# Altium project DB46.PRJPCB
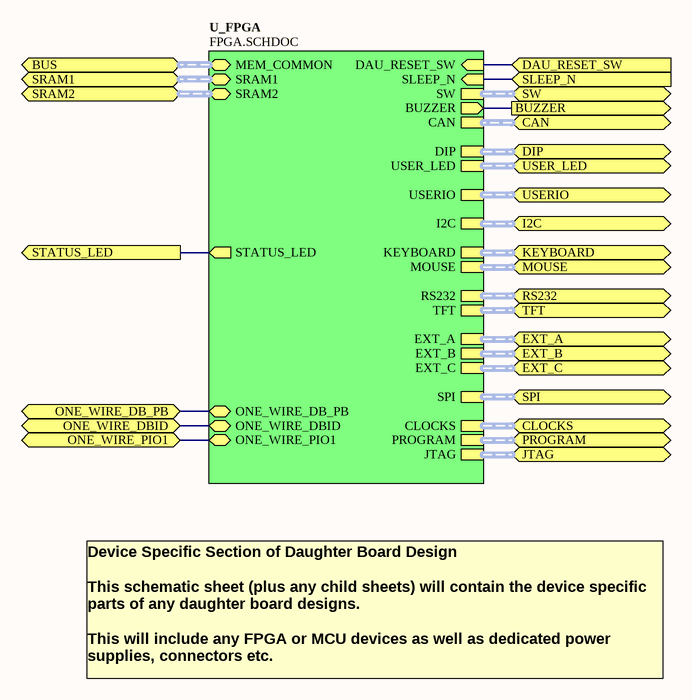
[diagram p0: DEVICES.SchDoc]
ProjectAddress1: L3, 12A Rodborough Road; ProjectAddress2: Frenchs Forest; ProjectAddress3: NSW 2086; ProjectAddress4: Australia; ProjectAssyNum: D-820-0031; ProjectOrganization: Altium Limited; ProjectRevision: 02; ProjectTitle: DB46 - Virtex4 SX35; ProjectTotalSheets: 23
9 sheets, 100 parts. Net scope: hierarchical (ports join the sheet entries above them; power ports are global).
Board files: DB46.PcbDoc, DB46_Panel.PcbDoc
Sheets:
  DEVICES.SchDoc
    U_FPGA = FPGA.SCHDOC
      U_FPGA_Power = FPGA_NonIO.SchDoc
      U_Bypass_3V3 = Bypass_FPGA_3V3.SchDoc
      U_Bypass_2V5 = Bypass_FPGA_2V5.SCHDOC
      U_Bypass_1V2 = Bypass_FPGA_1V2.SCHDOC
  DB46_Top.SchDoc
    U_PSU = PSU.SCHDOC
    U_DB46_Hardware_Kit = DB46_Hardware_Kit.SchDoc

## Sheet DEVICES.SchDoc: FPGA, LEDs and SRAM Memory
size A4; Organization: Altium Limited.; Address1: Level 3, 12a Rodborough Rd; Address2: Frenchs Forest 2086; Address3: NSW; Address4: AUSTRALIA; DocumentNumber: 2; SheetNumber: 3; SheetTotal: 23

### Sub-sheets
U_FPGA = FPGA.SCHDOC: SRAM1 (harness SRAM-256Kx16), SRAM2 (harness SRAM-256Kx16), MEM_COMMON (harness HOSTMEMORY), DAU_RESET_SW (in), BUZZER (out), ONE_WIRE_DBID (bidir), ONE_WIRE_DB_PB (bidir), ONE_WIRE_PIO1 (bidir), JTAG (harness HardSoft_JTAG), SW (harness SW5), DIP (harness SW8), USERIO (harness IO36), EXT_A (harness PBIO), EXT_B (harness PBIO), EXT_C (harness PBIO), USER_LED (harness LED8), SPI (harness DAU_SPI), I2C (harness I2C), CAN (harness CAN_INT), RS232 (harness RS232_INT), KEYBOARD (harness PS2), MOUSE (harness PS2), TFT (harness DAU_TFT), PROGRAM (harness DAU_CTRL), CLOCKS (harness DAU_CLK), STATUS_LED (out), SLEEP_N (in)

### Ports
BUS (harness HOSTMEMORY), BUZZER (out), CAN, CLOCKS, DAU_RESET_SW (in), DIP, EXT_A, EXT_B, EXT_C, I2C, JTAG, KEYBOARD, MOUSE, ONE_WIRE_DB_PB (bidir), ONE_WIRE_DBID (bidir), ONE_WIRE_PIO1 (bidir), PROGRAM, RS232, SLEEP_N (in), SPI, SRAM1, SRAM2 (harness SRAM-256Kx16), STATUS_LED (out), SW, TFT, USER_LED, USERIO

### Nets
BUZZER: port BUZZER, sheet U_FPGA/BUZZER
DAU_RESET_SW: port DAU_RESET_SW, sheet U_FPGA/DAU_RESET_SW
ONE_WIRE_DB_PB: port ONE_WIRE_DB_PB, sheet U_FPGA/ONE_WIRE_DB_PB
ONE_WIRE_DBID: port ONE_WIRE_DBID, sheet U_FPGA/ONE_WIRE_DBID
ONE_WIRE_PIO1: port ONE_WIRE_PIO1, sheet U_FPGA/ONE_WIRE_PIO1
SLEEP_N: port SLEEP_N, sheet U_FPGA/SLEEP_N
STATUS_LED: port STATUS_LED, sheet U_FPGA/STATUS_LED

### Buses and harness runs
harness port BUS = sheet U_FPGA/MEM_COMMON
harness port CAN = sheet U_FPGA/CAN
harness port CLOCKS = sheet U_FPGA/CLOCKS
harness port DIP = sheet U_FPGA/DIP
harness port EXT_A = sheet U_FPGA/EXT_A
harness port EXT_B = sheet U_FPGA/EXT_B
harness port EXT_C = sheet U_FPGA/EXT_C
harness port I2C = sheet U_FPGA/I2C
harness port JTAG = sheet U_FPGA/JTAG
harness port KEYBOARD = sheet U_FPGA/KEYBOARD
harness port MOUSE = sheet U_FPGA/MOUSE
harness port PROGRAM = sheet U_FPGA/PROGRAM
harness port RS232 = sheet U_FPGA/RS232
harness port SPI = sheet U_FPGA/SPI
harness port SRAM1 = sheet U_FPGA/SRAM1
harness port SRAM2 = sheet U_FPGA/SRAM2
harness port SW = sheet U_FPGA/SW
harness port TFT = sheet U_FPGA/TFT
harness port USER_LED = sheet U_FPGA/USER_LED
harness port USERIO = sheet U_FPGA/USERIO

### Notes on the sheet
- Device Specific Section of Daughter Board Design
  This schematic sheet (plus any child sheets) will contain the device specific parts of any daughter board designs.
  This will include any FPGA or MCU devices as well as dedicated power supplies, connectors etc.
- Sheet Title
- Project Title
- Size:
- Date:
- A4
- Assy:
- Time:
- Revision:
- Sheet
- of
- File:

## Sheet FPGA.SCHDOC: FPGA Connections
size A2; Organization: Altium Limited.; Address1: Level 3, 12a Rodborough Rd; Address2: Frenchs Forest 2086; Address3: NSW; Address4: AUSTRALIA; DocumentNumber: 3; SheetNumber: 4; SheetTotal: 23; PageSetup: Record=PageOptions|CenterHorizontal=True|CenterVertical=True|PrintScale=0.71|XCorrection=1.00|YCorrection=1.00|PrintKind=0|BorderSize=5000000|LeftOffset=0|BottomOffset=0|Orientation=2|PaperLength=4199|PaperWidth=2969|Scale=100|PaperSource=7|PrintQuality=600|MediaType=1|DitherType=10|PaperKind=A3 (297 x 420 mm)|PrintScaleMode=1
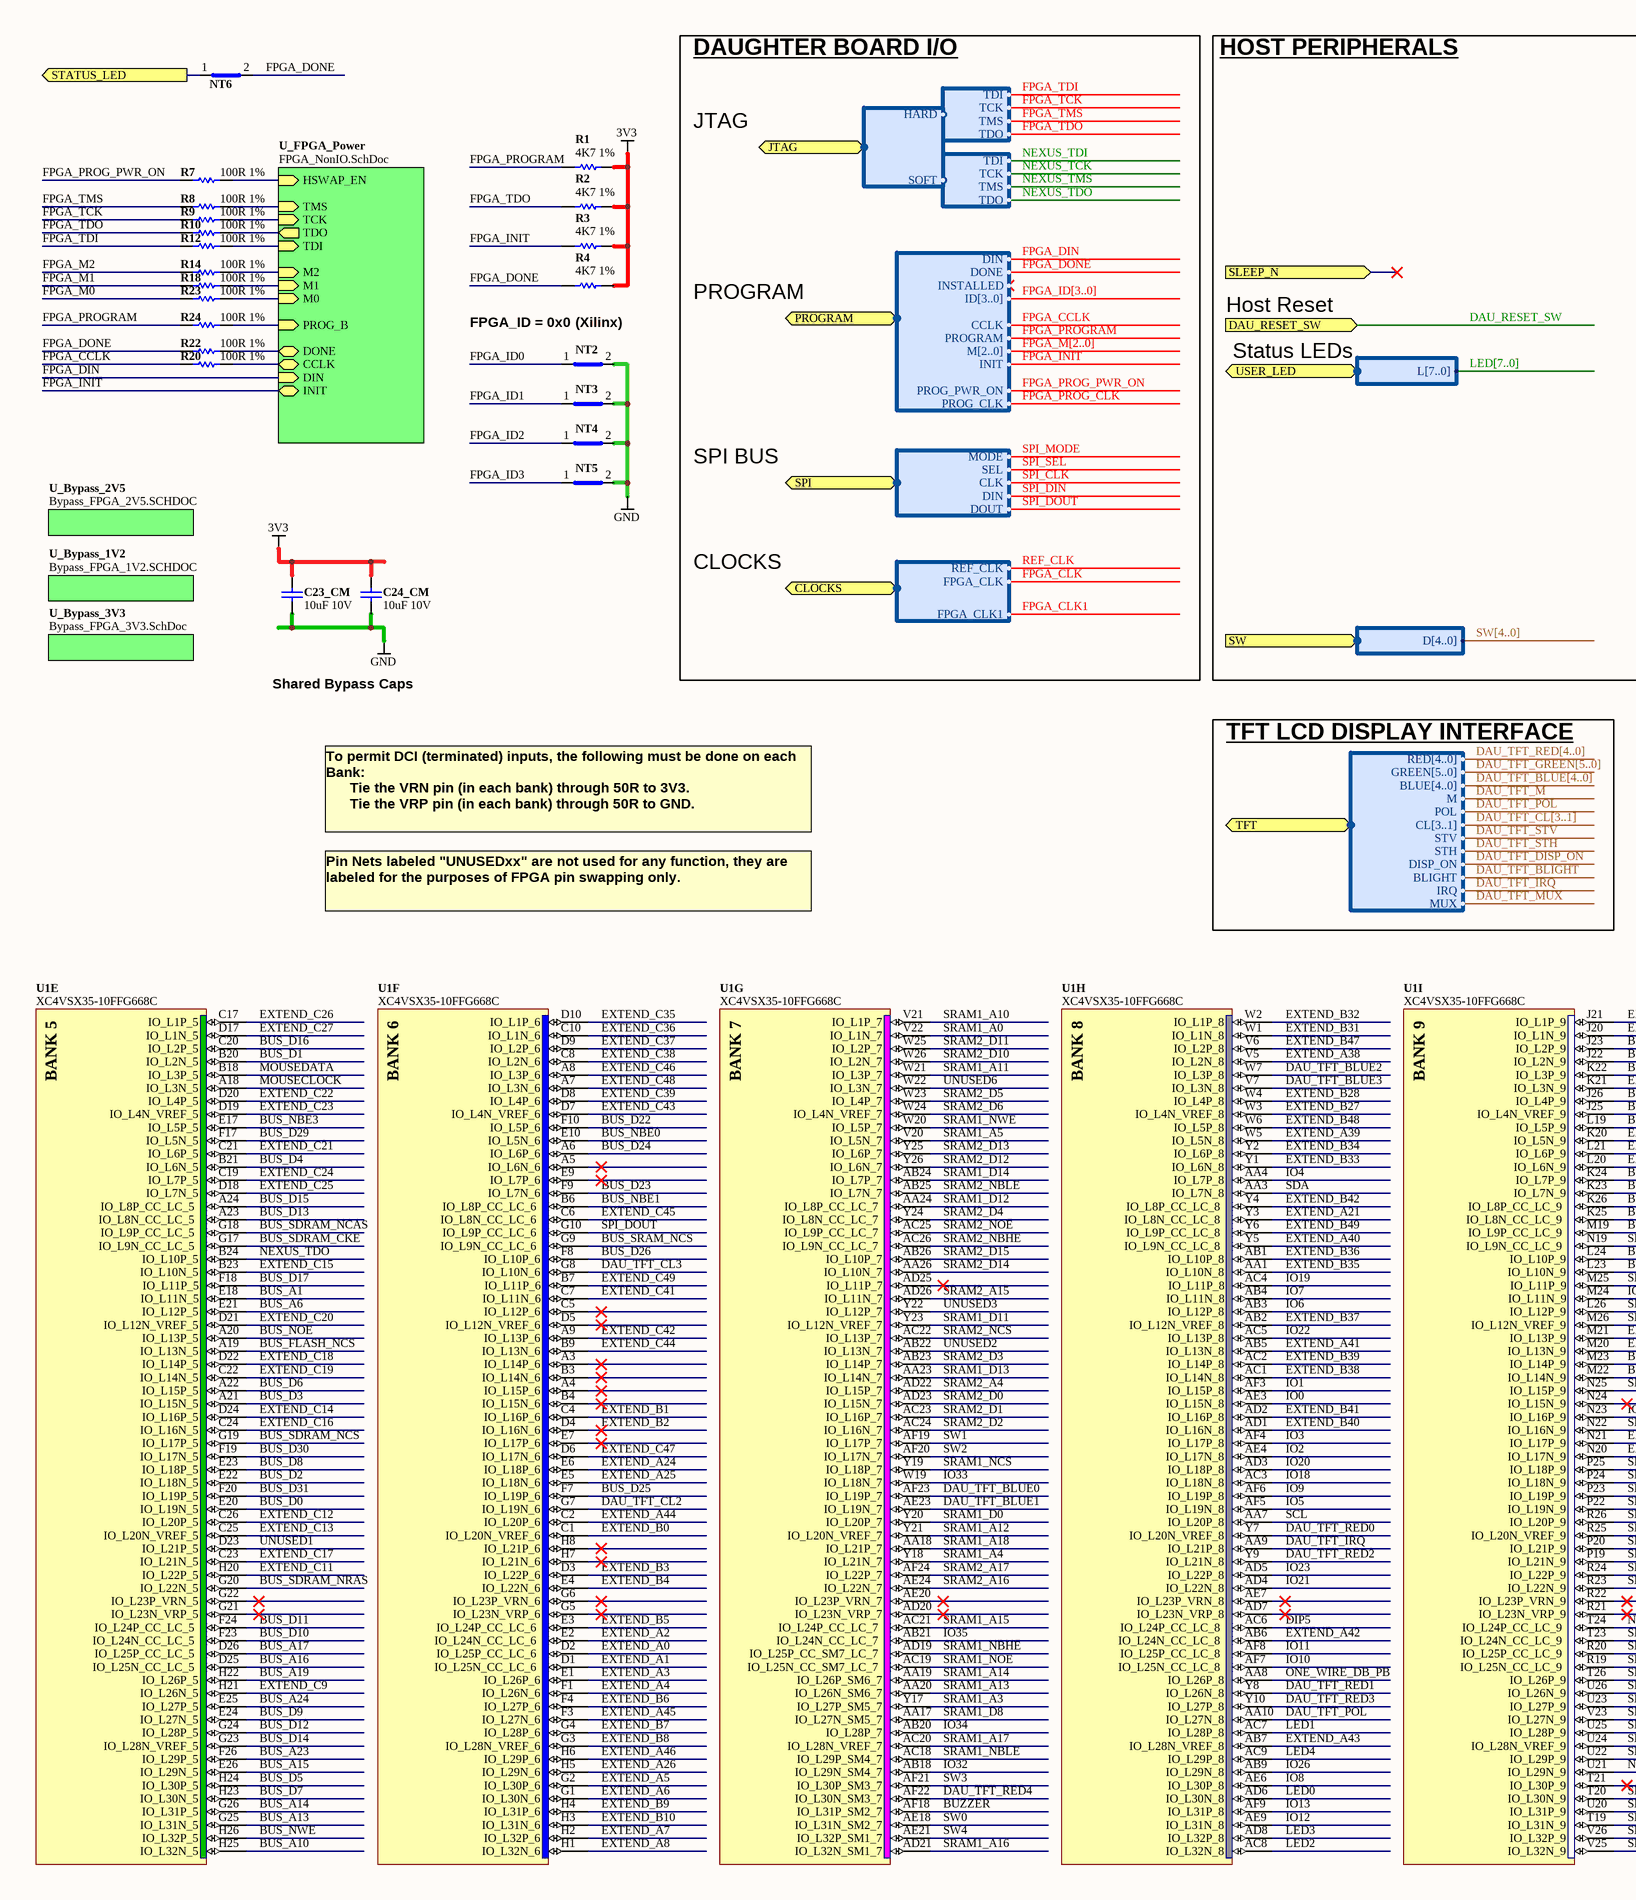
[diagram p1: FPGA.SCHDOC, left]
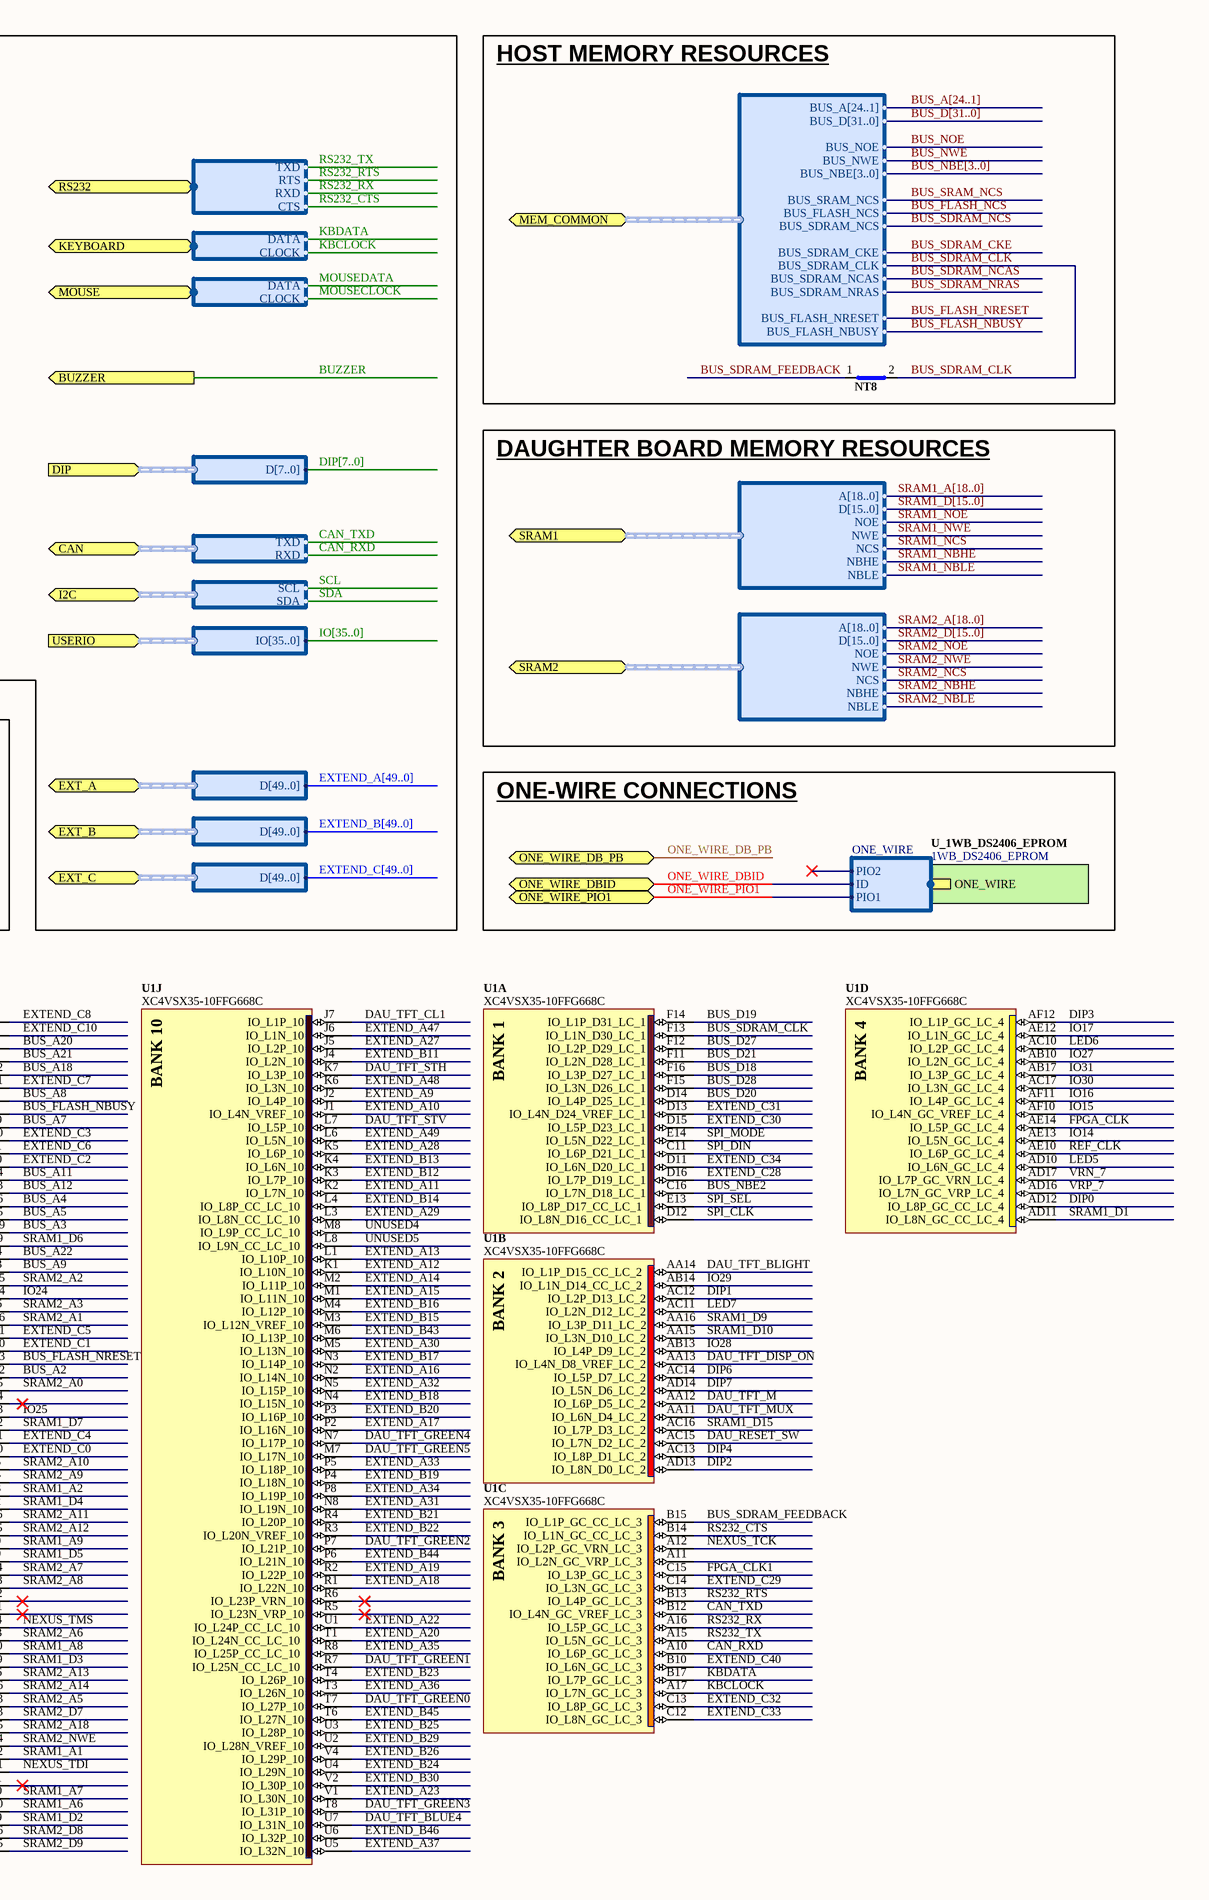
[diagram p2: FPGA.SCHDOC, right]

### Parts
C23_CM  10uF 10V  [CAPC2012-STAR]
C24_CM  10uF 10V  [CAPC2012-STAR]
NT2  Net Tie SMT2  [NETTIE-SMT2-8X8]  (value not drawn)  (net tie, no BOM)
NT3  Net Tie SMT2  [NETTIE-SMT2-8X8]  (value not drawn)  (net tie, no BOM)
NT4  Net Tie SMT2  [NETTIE-SMT2-8X8]  (value not drawn)  (net tie, no BOM)
NT5  Net Tie SMT2  [NETTIE-SMT2-8X8]  (value not drawn)  (net tie, no BOM)
NT6  Net Tie SMT2  [NETTIE-SMT2-8X8]  (value not drawn)  (net tie, no BOM)
NT8  Net Tie SMT2  [NETTIE-SMT2-8X8]  (value not drawn)  (net tie, no BOM)
R1  4K7 1%  [RESC1005-STAR]
R2  4K7 1%  [RESC1005-STAR]
R3  4K7 1%  [RESC1005-STAR]
R4  4K7 1%  [RESC1005-STAR]
R7  100R 1%  [RESC1005-STAR]
R8  100R 1%  [RESC1005-STAR]
R9  100R 1%  [RESC1005-STAR]
R10  100R 1%  [RESC1005-STAR]
R12  100R 1%  [RESC1005-STAR]
R14  100R 1%  [RESC1005-STAR]
R18  100R 1%  [RESC1005-STAR]
R20  100R 1%  [RESC1005-STAR]
R22  100R 1%  [RESC1005-STAR]
R23  100R 1%  [RESC1005-STAR]
R24  100R 1%  [RESC1005-STAR]
U1  XC4VSX35-10FFG668C  [XC4VLX25-10FF668C]  (parts A,B,C,D,E,F,G,H,I,J of 14)

### Blocks framed on the sheet
HOST MEMORY RESOURCES: NT8

### Sub-sheets
U_1WB_DS2406_EPROM = 1WB_DS2406_EPROM (file not in this document): ONE_WIRE (harness ONE_WIRE)
U_Bypass_1V2 = Bypass_FPGA_1V2.SCHDOC: no entries
U_Bypass_2V5 = Bypass_FPGA_2V5.SCHDOC: no entries
U_Bypass_3V3 = Bypass_FPGA_3V3.SchDoc: no entries
U_FPGA_Power = FPGA_NonIO.SchDoc: TMS (in), DONE (bidir), M1 (in), CCLK (bidir), M0 (in), M2 (in), TCK (in), HSWAP_EN (in), TDI (in), PROG_B (in), TDO (out), DIN (in), INIT (bidir)

### Ports
BUZZER (out), CAN (harness CAN_INT), CLOCKS (harness DAU_CLK), DAU_RESET_SW (in), DIP (harness SW8), EXT_A (harness PBIO), EXT_B (harness PBIO), EXT_C (harness PBIO), I2C (harness I2C), JTAG (harness HARDSOFT_JTAG), KEYBOARD (harness PS2), MEM_COMMON (harness HOSTMEMORY), MOUSE (harness PS2), ONE_WIRE_DB_PB (bidir), ONE_WIRE_DBID (bidir), ONE_WIRE_PIO1 (bidir), PROGRAM (harness DAU_CTRL), RS232 (harness RS232_INT), SLEEP_N (in), SPI (harness DAU_SPI), SRAM1 (harness SRAM-256Kx16), SRAM2 (harness SRAM-256Kx16), STATUS_LED (out), SW (harness SW5), TFT (harness DAU_TFT), USER_LED (harness LED8), USERIO (harness IO36)

### Harnesses
ONE_WIRE: ID, PIO1, PIO2
SRAM-256Kx16: A[18..0], D[15..0], NCS, NWE, NOE, NBHE, NBLE
HOSTMEMORY: BUS_A[24..1], BUS_D[31..0], BUS_NOE, BUS_NWE, BUS_NBE[3..0], BUS_SRAM_NCS, BUS_FLASH_NCS, BUS_SDRAM_NCS, BUS_SDRAM_CKE, BUS_SDRAM_CLK, BUS_SDRAM_NCAS, BUS_SDRAM_NRAS, BUS_FLASH_NRESET, BUS_FLASH_NBUSY
DAU_CLK: REF_CLK, FPGA_CLK, FPGA_CLK1
DAU_SPI: MODE, SEL, CLK, DIN, DOUT
DAU_CTRL: DIN, DONE, INSTALLED, ID[3..0], CCLK, PROGRAM, M[2..0], INIT, PROG_PWR_ON, PROG_CLK
JTAG: TMS, TDO, TDI, TCK
HARDSOFT_JTAG: HARD, SOFT
LED8: L[7..0]
SW5: D[4..0]
DAU_TFT: RED[4..0], GREEN[5..0], BLUE[4..0], M, POL, CL[3..1], STV, STH, DISP_ON, BLIGHT, IRQ, MUX
PS2: DATA, CLOCK
RS232_INT: RXD, TXD, RTS, CTS
IO36: IO[35..0]
SW8: D[7..0]
CAN_INT: TXD, RXD
I2C: SCL, SDA
PBIO: D[49..0]

### Nets
3V3: C23_CM.1 C24_CM.1 R1.2 R2.2 R3.2 R4.2
GND: C23_CM.2 C24_CM.2 NT2.2(Net2) NT3.2(Net2) NT4.2(Net2) NT5.2(Net2)
BUS_A1: U1.E18(IO_L11N_5)
BUS_A2: U1.M22(IO_L14N_9)
BUS_A3: U1.M19(IO_L9P_CC_LC_9)
BUS_A4: U1.K26(IO_L8P_CC_LC_9)
BUS_A5: U1.K25(IO_L8N_CC_LC_9)
BUS_A6: U1.E21(IO_L12P_5)
BUS_A7: U1.L19(IO_L5P_9)
BUS_A8: U1.J26(IO_L4P_9)
BUS_A9: U1.L23(IO_L10N_9)
BUS_A10: U1.H25(IO_L32N_5)
BUS_A11: U1.K24(IO_L7P_9)
BUS_A12: U1.K23(IO_L7N_9)
BUS_A13: U1.G25(IO_L31N_5)
BUS_A14: U1.G26(IO_L31P_5)
BUS_A15: U1.E26(IO_L29N_5)
BUS_A16: U1.D25(IO_L25N_CC_LC_5)
BUS_A17: U1.D26(IO_L25P_CC_LC_5)
BUS_A18: U1.K22(IO_L3P_9)
BUS_A19: U1.H22(IO_L26P_5)
BUS_A20: U1.J23(IO_L2P_9)
BUS_A21: U1.J22(IO_L2N_9)
BUS_A22: U1.L24(IO_L10P_9)
BUS_A23: U1.F26(IO_L29P_5)
BUS_A24: U1.E25(IO_L27P_5)
BUS_D0: U1.E20(IO_L19N_5)
BUS_D1: U1.B20(IO_L2N_5)
BUS_D2: U1.E22(IO_L18N_5)
BUS_D3: U1.A21(IO_L15N_5)
BUS_D4: U1.B21(IO_L6N_5)
BUS_D5: U1.H24(IO_L30P_5)
BUS_D6: U1.A22(IO_L15P_5)
BUS_D7: U1.H23(IO_L30N_5)
BUS_D8: U1.E23(IO_L18P_5)
BUS_D9: U1.E24(IO_L27N_5)
BUS_D10: U1.F23(IO_L24N_CC_LC_5)
BUS_D11: U1.F24(IO_L24P_CC_LC_5)
BUS_D12: U1.G24(IO_L28P_5)
BUS_D13: U1.A23(IO_L8N_CC_LC_5)
BUS_D14: U1.G23(IO_L28N_VREF_5)
BUS_D15: U1.A24(IO_L8P_CC_LC_5)
BUS_D16: U1.C20(IO_L2P_5)
BUS_D17: U1.F18(IO_L11P_5)
BUS_D18: U1.F16(IO_L3P_D27_LC_1)
BUS_D19: U1.F14(IO_L1P_D31_LC_1)
BUS_D20: U1.D14(IO_L4P_D25_LC_1)
BUS_D21: U1.F11(IO_L2N_D28_LC_1)
BUS_D22: U1.F10(IO_L5P_6)
BUS_D23: U1.F9(IO_L7N_6)
BUS_D24: U1.A6(IO_L6P_6)
BUS_D25: U1.F7(IO_L19P_6)
BUS_D26: U1.F8(IO_L10P_6)
BUS_D27: U1.F12(IO_L2P_D29_LC_1)
BUS_D28: U1.F15(IO_L3N_D26_LC_1)
BUS_D29: U1.F17(IO_L5N_5)
BUS_D30: U1.F19(IO_L17N_5)
BUS_D31: U1.F20(IO_L19P_5)
BUS_FLASH_NBUSY: U1.J25(IO_L4N_VREF_9) ; port MEM_COMMON.BUS_FLASH_NBUSY
BUS_FLASH_NCS: U1.A19(IO_L13N_5) ; port MEM_COMMON.BUS_FLASH_NCS
BUS_FLASH_NRESET: U1.M23(IO_L14P_9) ; port MEM_COMMON.BUS_FLASH_NRESET
BUS_NBE0: U1.E10(IO_L5N_6)
BUS_NBE1: U1.B6(IO_L8P_CC_LC_6)
BUS_NBE2: U1.C16(IO_L7N_D18_LC_1)
BUS_NBE3: U1.E17(IO_L5P_5)
BUS_NOE: U1.A20(IO_L13P_5) ; port MEM_COMMON.BUS_NOE
BUS_NWE: U1.H26(IO_L32P_5) ; port MEM_COMMON.BUS_NWE
BUS_SDRAM_CKE: U1.G17(IO_L9N_CC_LC_5) ; port MEM_COMMON.BUS_SDRAM_CKE
BUS_SDRAM_CLK: NT8.2(Net2) U1.F13(IO_L1N_D30_LC_1) ; port MEM_COMMON.BUS_SDRAM_CLK
BUS_SDRAM_FEEDBACK: NT8.1(Net1) U1.B15(IO_L1P_GC_CC_LC_3)
BUS_SDRAM_NCAS: U1.G18(IO_L9P_CC_LC_5) ; port MEM_COMMON.BUS_SDRAM_NCAS
BUS_SDRAM_NCS: U1.G19(IO_L17P_5) ; port MEM_COMMON.BUS_SDRAM_NCS
BUS_SDRAM_NRAS: U1.G20(IO_L22N_5) ; port MEM_COMMON.BUS_SDRAM_NRAS
BUS_SRAM_NCS: U1.G9(IO_L9N_CC_LC_6) ; port MEM_COMMON.BUS_SRAM_NCS
BUZZER: U1.AF18(IO_L31P_SM2_7) ; port BUZZER
CAN_RXD: U1.A10(IO_L6P_GC_LC_3) ; port CAN.RXD
CAN_TXD: U1.B12(IO_L4N_GC_VREF_LC_3) ; port CAN.TXD
CCLK: R20.2 ; sheet U_FPGA_Power/CCLK
DAU_RESET_SW: U1.AC15(IO_L7N_D2_LC_2) ; port DAU_RESET_SW
DAU_TFT_BLIGHT: U1.AA14(IO_L1P_D15_CC_LC_2) ; port TFT.BLIGHT
DAU_TFT_BLUE0: U1.AF23(IO_L19P_7)
DAU_TFT_BLUE1: U1.AE23(IO_L19N_7)
DAU_TFT_BLUE2: U1.W7(IO_L3P_8)
DAU_TFT_BLUE3: U1.V7(IO_L3N_8)
DAU_TFT_BLUE4: U1.U7(IO_L31N_10)
DAU_TFT_CL1: U1.J7(IO_L1P_10)
DAU_TFT_CL2: U1.G7(IO_L19N_6)
DAU_TFT_CL3: U1.G8(IO_L10N_6)
DAU_TFT_DISP_ON: U1.AA13(IO_L4N_D8_VREF_LC_2) ; port TFT.DISP_ON
DAU_TFT_GREEN0: U1.T7(IO_L27P_10)
DAU_TFT_GREEN1: U1.R7(IO_L25N_CC_LC_10)
DAU_TFT_GREEN2: U1.P7(IO_L21P_10)
DAU_TFT_GREEN3: U1.T8(IO_L31P_10)
DAU_TFT_GREEN4: U1.N7(IO_L17P_10)
DAU_TFT_GREEN5: U1.M7(IO_L17N_10)
DAU_TFT_IRQ: U1.AA9(IO_L21P_8) ; port TFT.IRQ
DAU_TFT_M: U1.AA12(IO_L6P_D5_LC_2) ; port TFT.M
DAU_TFT_MUX: U1.AA11(IO_L6N_D4_LC_2) ; port TFT.MUX
DAU_TFT_POL: U1.AA10(IO_L27N_8) ; port TFT.POL
DAU_TFT_RED0: U1.Y7(IO_L20N_VREF_8)
DAU_TFT_RED1: U1.Y8(IO_L26N_8)
DAU_TFT_RED2: U1.Y9(IO_L21N_8)
DAU_TFT_RED3: U1.Y10(IO_L27P_8)
DAU_TFT_RED4: U1.AF22(IO_L30N_SM3_7)
DAU_TFT_STH: U1.K7(IO_L3P_10) ; port TFT.STH
DAU_TFT_STV: U1.L7(IO_L5P_10) ; port TFT.STV
DIP0: U1.AD12(IO_L8P_GC_CC_LC_4)
DIP1: U1.AC12(IO_L2P_D13_LC_2)
DIP2: U1.AD13(IO_L8N_D0_LC_2)
DIP3: U1.AF12(IO_L1P_GC_LC_4)
DIP4: U1.AC13(IO_L8P_D1_LC_2)
DIP5: U1.AC6(IO_L24P_CC_LC_8)
DIP6: U1.AC14(IO_L5P_D7_LC_2)
DIP7: U1.AD14(IO_L5N_D6_LC_2)
DONE: R22.2 ; sheet U_FPGA_Power/DONE
EXTEND_A0: U1.D2(IO_L25P_CC_LC_6)
EXTEND_A1: U1.D1(IO_L25N_CC_LC_6)
EXTEND_A2: U1.E2(IO_L24N_CC_LC_6)
EXTEND_A3: U1.E1(IO_L26P_6)
EXTEND_A4: U1.F1(IO_L26N_6)
EXTEND_A5: U1.G2(IO_L30P_6)
EXTEND_A6: U1.G1(IO_L30N_6)
EXTEND_A7: U1.H2(IO_L32P_6)
EXTEND_A8: U1.H1(IO_L32N_6)
EXTEND_A9: U1.J2(IO_L4P_10)
EXTEND_A10: U1.J1(IO_L4N_VREF_10)
EXTEND_A11: U1.K2(IO_L7N_10)
EXTEND_A12: U1.K1(IO_L10N_10)
EXTEND_A13: U1.L1(IO_L10P_10)
EXTEND_A14: U1.M2(IO_L11P_10)
EXTEND_A15: U1.M1(IO_L11N_10)
EXTEND_A16: U1.N2(IO_L14N_10)
EXTEND_A17: U1.P2(IO_L16N_10)
EXTEND_A18: U1.R1(IO_L22N_10)
EXTEND_A19: U1.R2(IO_L22P_10)
EXTEND_A20: U1.T1(IO_L24N_CC_LC_10)
EXTEND_A21: U1.Y3(IO_L8N_CC_LC_8)
EXTEND_A22: U1.U1(IO_L24P_CC_LC_10)
EXTEND_A23: U1.V1(IO_L30N_10)
EXTEND_A24: U1.E6(IO_L18P_6)
EXTEND_A25: U1.E5(IO_L18N_6)
EXTEND_A26: U1.H5(IO_L29N_6)
EXTEND_A27: U1.J5(IO_L2P_10)
EXTEND_A28: U1.K5(IO_L6P_10)
EXTEND_A29: U1.L3(IO_L8N_CC_LC_10)
EXTEND_A30: U1.M5(IO_L13N_10)
EXTEND_A31: U1.N8(IO_L19N_10)
EXTEND_A32: U1.N5(IO_L15P_10)
EXTEND_A33: U1.P5(IO_L18P_10)
EXTEND_A34: U1.P8(IO_L19P_10)
EXTEND_A35: U1.R8(IO_L25P_CC_LC_10)
EXTEND_A36: U1.T3(IO_L26N_10)
EXTEND_A37: U1.U5(IO_L32N_10)
EXTEND_A38: U1.V5(IO_L2N_8)
EXTEND_A39: U1.W5(IO_L5N_8)
EXTEND_A40: U1.Y5(IO_L9N_CC_LC_8)
EXTEND_A41: U1.AB5(IO_L13N_8)
EXTEND_A42: U1.AB6(IO_L24N_CC_LC_8)
EXTEND_A43: U1.AB7(IO_L28N_VREF_8)
EXTEND_A44: U1.C2(IO_L20P_6)
EXTEND_A45: U1.F3(IO_L27N_6)
EXTEND_A46: U1.H6(IO_L29P_6)
EXTEND_A47: U1.J6(IO_L1N_10)
EXTEND_A48: U1.K6(IO_L3N_10)
EXTEND_A49: U1.L6(IO_L5N_10)
EXTEND_B0: U1.C1(IO_L20N_VREF_6)
EXTEND_B1: U1.C4(IO_L16P_6)
EXTEND_B2: U1.D4(IO_L16N_6)
EXTEND_B3: U1.D3(IO_L22P_6)
EXTEND_B4: U1.E4(IO_L22N_6)
EXTEND_B5: U1.E3(IO_L24P_CC_LC_6)
EXTEND_B6: U1.F4(IO_L27P_6)
EXTEND_B7: U1.G4(IO_L28P_6)
EXTEND_B8: U1.G3(IO_L28N_VREF_6)
EXTEND_B9: U1.H4(IO_L31P_6)
EXTEND_B10: U1.H3(IO_L31N_6)
EXTEND_B11: U1.J4(IO_L2N_10)
EXTEND_B12: U1.K3(IO_L7P_10)
EXTEND_B13: U1.K4(IO_L6N_10)
EXTEND_B14: U1.L4(IO_L8P_CC_LC_10)
EXTEND_B15: U1.M3(IO_L12N_VREF_10)
EXTEND_B16: U1.M4(IO_L12P_10)
EXTEND_B17: U1.N3(IO_L14P_10)
EXTEND_B18: U1.N4(IO_L15N_10)
EXTEND_B19: U1.P4(IO_L18N_10)
EXTEND_B20: U1.P3(IO_L16P_10)
EXTEND_B21: U1.R4(IO_L20P_10)
EXTEND_B22: U1.R3(IO_L20N_VREF_10)
EXTEND_B23: U1.T4(IO_L26P_10)
EXTEND_B24: U1.U4(IO_L29N_10)
EXTEND_B25: U1.U3(IO_L28P_10)
EXTEND_B26: U1.V4(IO_L29P_10)
EXTEND_B27: U1.W3(IO_L4N_VREF_8)
EXTEND_B28: U1.W4(IO_L4P_8)
EXTEND_B29: U1.U2(IO_L28N_VREF_10)
EXTEND_B30: U1.V2(IO_L30P_10)
EXTEND_B31: U1.W1(IO_L1N_8)
EXTEND_B32: U1.W2(IO_L1P_8)
EXTEND_B33: U1.Y1(IO_L6N_8)
EXTEND_B34: U1.Y2(IO_L6P_8)
EXTEND_B35: U1.AA1(IO_L10N_8)
EXTEND_B36: U1.AB1(IO_L10P_8)
EXTEND_B37: U1.AB2(IO_L12N_VREF_8)
EXTEND_B38: U1.AC1(IO_L14N_8)
EXTEND_B39: U1.AC2(IO_L14P_8)
EXTEND_B40: U1.AD1(IO_L16N_8)
EXTEND_B41: U1.AD2(IO_L16P_8)
EXTEND_B42: U1.Y4(IO_L8P_CC_LC_8)
EXTEND_B43: U1.M6(IO_L13P_10)
EXTEND_B44: U1.P6(IO_L21N_10)
EXTEND_B45: U1.T6(IO_L27N_10)
EXTEND_B46: U1.U6(IO_L32P_10)
EXTEND_B47: U1.V6(IO_L2P_8)
EXTEND_B48: U1.W6(IO_L5P_8)
EXTEND_B49: U1.Y6(IO_L9P_CC_LC_8)
EXTEND_C0: U1.N20(IO_L17N_9)
EXTEND_C1: U1.M20(IO_L13N_9)
EXTEND_C2: U1.L20(IO_L6N_9)
EXTEND_C3: U1.K20(IO_L5N_9)
EXTEND_C4: U1.N21(IO_L17P_9)
EXTEND_C5: U1.M21(IO_L13P_9)
EXTEND_C6: U1.L21(IO_L6P_9)
EXTEND_C7: U1.K21(IO_L3N_9)
EXTEND_C8: U1.J21(IO_L1P_9)
EXTEND_C9: U1.H21(IO_L26N_5)
EXTEND_C10: U1.J20(IO_L1N_9)
EXTEND_C11: U1.H20(IO_L22P_5)
EXTEND_C12: U1.C26(IO_L20P_5)
EXTEND_C13: U1.C25(IO_L20N_VREF_5)
EXTEND_C14: U1.D24(IO_L16P_5)
EXTEND_C15: U1.B23(IO_L10N_5)
EXTEND_C16: U1.C24(IO_L16N_5)
EXTEND_C17: U1.C23(IO_L21N_5)
EXTEND_C18: U1.D22(IO_L14P_5)
EXTEND_C19: U1.C22(IO_L14N_5)
EXTEND_C20: U1.D21(IO_L12N_VREF_5)
EXTEND_C21: U1.C21(IO_L6P_5)
EXTEND_C22: U1.D20(IO_L4P_5)
EXTEND_C23: U1.D19(IO_L4N_VREF_5)
EXTEND_C24: U1.C19(IO_L7P_5)
EXTEND_C25: U1.D18(IO_L7N_5)
EXTEND_C26: U1.C17(IO_L1P_5)
EXTEND_C27: U1.D17(IO_L1N_5)
EXTEND_C28: U1.D16(IO_L7P_D19_LC_1)
EXTEND_C29: U1.C14(IO_L3N_GC_LC_3)
EXTEND_C30: U1.D15(IO_L5P_D23_LC_1)
EXTEND_C31: U1.D13(IO_L4N_D24_VREF_LC_1)
EXTEND_C32: U1.C13(IO_L8P_GC_LC_3)
EXTEND_C33: U1.C12(IO_L8N_GC_LC_3)
EXTEND_C34: U1.D11(IO_L6N_D20_LC_1)
EXTEND_C35: U1.D10(IO_L1P_6)
EXTEND_C36: U1.C10(IO_L1N_6)
EXTEND_C37: U1.D9(IO_L2P_6)
EXTEND_C38: U1.C8(IO_L2N_6)
EXTEND_C39: U1.D8(IO_L4P_6)
EXTEND_C40: U1.B10(IO_L6N_GC_LC_3)
EXTEND_C41: U1.C7(IO_L11N_6)
EXTEND_C42: U1.A9(IO_L13P_6)
EXTEND_C43: U1.D7(IO_L4N_VREF_6)
EXTEND_C44: U1.B9(IO_L13N_6)
EXTEND_C45: U1.C6(IO_L8N_CC_LC_6)
EXTEND_C46: U1.A8(IO_L3P_6)
EXTEND_C47: U1.D6(IO_L17N_6)
EXTEND_C48: U1.A7(IO_L3N_6)
EXTEND_C49: U1.B7(IO_L11P_6)
FPGA_CCLK: R20.1 ; port PROGRAM.CCLK
FPGA_CLK: U1.AE14(IO_L5P_GC_LC_4) ; port CLOCKS.FPGA_CLK
FPGA_CLK1: U1.C15(IO_L3P_GC_LC_3) ; port CLOCKS.FPGA_CLK1
FPGA_DIN: sheet U_FPGA_Power/DIN, port PROGRAM.DIN
FPGA_DONE: NT6.2(Net2) R4.1 R22.1 ; port PROGRAM.DONE
FPGA_ID0: NT2.1(Net1)
FPGA_ID1: NT3.1(Net1)
FPGA_ID2: NT4.1(Net1)
FPGA_ID3: NT5.1(Net1)
FPGA_INIT: R3.1 ; sheet U_FPGA_Power/INIT, port PROGRAM.INIT
FPGA_M0: R23.1
FPGA_M1: R18.1
FPGA_M2: R14.1
FPGA_PROG_CLK: port PROGRAM.PROG_CLK
FPGA_PROG_PWR_ON: R7.1 ; port PROGRAM.PROG_PWR_ON
FPGA_PROGRAM: R1.1 R24.1 ; port PROGRAM.PROGRAM
FPGA_TCK: R9.1 ; harness JTAG.TCK
FPGA_TDI: R12.1 ; harness JTAG.TDI
FPGA_TDO: R2.1 R10.1 ; harness JTAG.TDO
FPGA_TMS: R8.1 ; harness JTAG.TMS
HSWAP_EN: R7.2 ; sheet U_FPGA_Power/HSWAP_EN
IO0: U1.AE3(IO_L15N_8)
IO1: U1.AF3(IO_L15P_8)
IO2: U1.AE4(IO_L17N_8)
IO3: U1.AF4(IO_L17P_8)
IO4: U1.AA4(IO_L7P_8)
IO5: U1.AF5(IO_L19N_8)
IO6: U1.AB3(IO_L12P_8)
IO7: U1.AB4(IO_L11N_8)
IO8: U1.AE6(IO_L30P_8)
IO9: U1.AF6(IO_L19P_8)
IO10: U1.AF7(IO_L25N_CC_LC_8)
IO11: U1.AF8(IO_L25P_CC_LC_8)
IO12: U1.AE9(IO_L31N_8)
IO13: U1.AF9(IO_L31P_8)
IO14: U1.AE13(IO_L5N_GC_LC_4)
IO15: U1.AF10(IO_L4N_GC_VREF_LC_4)
IO16: U1.AF11(IO_L4P_GC_LC_4)
IO17: U1.AE12(IO_L1N_GC_LC_4)
IO18: U1.AC3(IO_L18N_8)
IO19: U1.AC4(IO_L11P_8)
IO20: U1.AD3(IO_L18P_8)
IO21: U1.AD4(IO_L22N_8)
IO22: U1.AC5(IO_L13P_8)
IO23: U1.AD5(IO_L22P_8)
IO24: U1.M24(IO_L11N_9)
IO25: U1.N23(IO_L16P_9)
IO26: U1.AB9(IO_L29N_8)
IO27: U1.AB10(IO_L2N_GC_LC_4)
IO28: U1.AB13(IO_L4P_D9_LC_2)
IO29: U1.AB14(IO_L1N_D14_CC_LC_2)
IO30: U1.AC17(IO_L3N_GC_LC_4)
IO31: U1.AB17(IO_L3P_GC_LC_4)
IO32: U1.AB18(IO_L29N_SM4_7)
IO33: U1.W19(IO_L18N_7)
IO34: U1.AB20(IO_L28P_7)
IO35: U1.AB21(IO_L24N_CC_LC_7)
KBCLOCK: U1.A17(IO_L7N_GC_LC_3) ; port KEYBOARD.CLOCK
KBDATA: U1.B17(IO_L7P_GC_LC_3) ; port KEYBOARD.DATA
LED0: U1.AD6(IO_L30N_8)
LED1: U1.AC7(IO_L28P_8)
LED2: U1.AC8(IO_L32N_8)
LED3: U1.AD8(IO_L32P_8)
LED4: U1.AC9(IO_L29P_8)
LED5: U1.AD10(IO_L6N_GC_LC_4)
LED6: U1.AC10(IO_L2P_GC_LC_4)
LED7: U1.AC11(IO_L2N_D12_LC_2)
M0: R23.2 ; sheet U_FPGA_Power/M0
M1: R18.2 ; sheet U_FPGA_Power/M1
M2: R14.2 ; sheet U_FPGA_Power/M2
MOUSECLOCK: U1.A18(IO_L3N_5) ; port MOUSE.CLOCK
MOUSEDATA: U1.B18(IO_L3P_5) ; port MOUSE.DATA
NEXUS_TCK: U1.A12(IO_L2P_GC_VRN_LC_3) ; harness JTAG.TCK
NEXUS_TDI: U1.U21(IO_L29N_9) ; harness JTAG.TDI
NEXUS_TDO: U1.B24(IO_L10P_5) ; harness JTAG.TDO
NEXUS_TMS: U1.T24(IO_L24P_CC_LC_9) ; harness JTAG.TMS
ONE_WIRE_DB_PB: U1.AA8(IO_L26P_8) ; port ONE_WIRE_DB_PB
ONE_WIRE_DBID: port ONE_WIRE_DBID, sheet U_1WB_DS2406_EPROM/ONE_WIRE.ID
ONE_WIRE_PIO1: port ONE_WIRE_PIO1, sheet U_1WB_DS2406_EPROM/ONE_WIRE.PIO1
PROG_B: R24.2 ; sheet U_FPGA_Power/PROG_B
REF_CLK: U1.AE10(IO_L6P_GC_LC_4) ; port CLOCKS.REF_CLK
RS232_CTS: U1.B14(IO_L1N_GC_CC_LC_3) ; port RS232.CTS
RS232_RTS: U1.B13(IO_L4P_GC_LC_3) ; port RS232.RTS
RS232_RX: U1.A16(IO_L5P_GC_LC_3) ; port RS232.RXD
RS232_TX: U1.A15(IO_L5N_GC_LC_3) ; port RS232.TXD
SCL: U1.AA7(IO_L20P_8) ; port I2C.SCL
SDA: U1.AA3(IO_L7N_8) ; port I2C.SDA
SPI_CLK: U1.D12(IO_L8N_D16_CC_LC_1) ; port SPI.CLK
SPI_DIN: U1.C11(IO_L6P_D21_LC_1) ; port SPI.DIN
SPI_DOUT: U1.G10(IO_L9P_CC_LC_6) ; port SPI.DOUT
SPI_MODE: U1.E14(IO_L5N_D22_LC_1) ; port SPI.MODE
SPI_SEL: U1.E13(IO_L8P_D17_CC_LC_1) ; port SPI.SEL
SRAM1_A0: U1.V22(IO_L1N_7)
SRAM1_A1: U1.U22(IO_L29P_9)
SRAM1_A2: U1.P23(IO_L19P_9)
SRAM1_A3: U1.Y17(IO_L27P_SM5_7)
SRAM1_A4: U1.Y18(IO_L21N_7)
SRAM1_A5: U1.V20(IO_L5N_7)
SRAM1_A6: U1.U20(IO_L31P_9)
SRAM1_A7: U1.T20(IO_L30N_9)
SRAM1_A8: U1.R20(IO_L25P_CC_LC_9)
SRAM1_A9: U1.P20(IO_L21P_9)
SRAM1_A10: U1.V21(IO_L1P_7)
SRAM1_A11: U1.W21(IO_L3P_7)
SRAM1_A12: U1.Y21(IO_L20N_VREF_7)
SRAM1_A13: U1.AA20(IO_L26N_SM6_7)
SRAM1_A14: U1.AA19(IO_L26P_SM6_7)
SRAM1_A15: U1.AC21(IO_L24P_CC_LC_7)
SRAM1_A16: U1.AD21(IO_L32N_SM1_7)
SRAM1_A17: U1.AC20(IO_L28N_VREF_7)
SRAM1_A18: U1.AA18(IO_L21P_7)
SRAM1_D0: U1.Y20(IO_L20P_7)
SRAM1_D1: U1.AD11(IO_L8N_GC_CC_LC_4)
SRAM1_D2: U1.T19(IO_L31N_9)
SRAM1_D3: U1.R19(IO_L25N_CC_LC_9)
SRAM1_D4: U1.P22(IO_L19N_9)
SRAM1_D5: U1.P19(IO_L21N_9)
SRAM1_D6: U1.N19(IO_L9N_CC_LC_9)
SRAM1_D7: U1.N22(IO_L16N_9)
SRAM1_D8: U1.AA17(IO_L27N_SM5_7)
SRAM1_D9: U1.AA16(IO_L3P_D11_LC_2)
SRAM1_D10: U1.AA15(IO_L3N_D10_LC_2)
SRAM1_D11: U1.Y23(IO_L12N_VREF_7)
SRAM1_D12: U1.AA24(IO_L8P_CC_LC_7)
SRAM1_D13: U1.AA23(IO_L14N_7)
SRAM1_D14: U1.AB24(IO_L7P_7)
SRAM1_D15: U1.AC16(IO_L7P_D3_LC_2)
SRAM1_NBHE: U1.AD19(IO_L25P_CC_SM7_LC_7) ; port SRAM1.NBHE
SRAM1_NBLE: U1.AC18(IO_L29P_SM4_7) ; port SRAM1.NBLE
SRAM1_NCS: U1.Y19(IO_L18P_7) ; port SRAM1.NCS
SRAM1_NOE: U1.AC19(IO_L25N_CC_SM7_LC_7) ; port SRAM1.NOE
SRAM1_NWE: U1.W20(IO_L5P_7) ; port SRAM1.NWE
SRAM2_A0: U1.N25(IO_L15P_9)
SRAM2_A1: U1.M26(IO_L12N_VREF_9)
SRAM2_A2: U1.M25(IO_L11P_9)
SRAM2_A3: U1.L26(IO_L12P_9)
SRAM2_A4: U1.AD22(IO_L15P_7)
SRAM2_A5: U1.U23(IO_L27P_9)
SRAM2_A6: U1.T23(IO_L24N_CC_LC_9)
SRAM2_A7: U1.R24(IO_L22P_9)
SRAM2_A8: U1.R23(IO_L22N_9)
SRAM2_A9: U1.P24(IO_L18N_9)
SRAM2_A10: U1.P25(IO_L18P_9)
SRAM2_A11: U1.R26(IO_L20P_9)
SRAM2_A12: U1.R25(IO_L20N_VREF_9)
SRAM2_A13: U1.T26(IO_L26P_9)
SRAM2_A14: U1.U26(IO_L26N_9)
SRAM2_A15: U1.AD26(IO_L11N_7)
SRAM2_A16: U1.AE24(IO_L22N_7)
SRAM2_A17: U1.AF24(IO_L22P_7)
SRAM2_A18: U1.U25(IO_L28P_9)
SRAM2_D0: U1.AD23(IO_L15N_7)
SRAM2_D1: U1.AC23(IO_L16P_7)
SRAM2_D2: U1.AC24(IO_L16N_7)
SRAM2_D3: U1.AB23(IO_L14P_7)
SRAM2_D4: U1.Y24(IO_L8N_CC_LC_7)
SRAM2_D5: U1.W23(IO_L4P_7)
SRAM2_D6: U1.W24(IO_L4N_VREF_7)
SRAM2_D7: U1.V23(IO_L27N_9)
SRAM2_D8: U1.V26(IO_L32P_9)
SRAM2_D9: U1.V25(IO_L32N_9)
SRAM2_D10: U1.W26(IO_L2N_7)
SRAM2_D11: U1.W25(IO_L2P_7)
SRAM2_D12: U1.Y26(IO_L6N_7)
SRAM2_D13: U1.Y25(IO_L6P_7)
SRAM2_D14: U1.AA26(IO_L10N_7)
SRAM2_D15: U1.AB26(IO_L10P_7)
SRAM2_NBHE: U1.AC26(IO_L9N_CC_LC_7) ; port SRAM2.NBHE
SRAM2_NBLE: U1.AB25(IO_L7N_7) ; port SRAM2.NBLE
SRAM2_NCS: U1.AC22(IO_L13P_7) ; port SRAM2.NCS
SRAM2_NOE: U1.AC25(IO_L9P_CC_LC_7) ; port SRAM2.NOE
SRAM2_NWE: U1.U24(IO_L28N_VREF_9) ; port SRAM2.NWE
STATUS_LED: NT6.1(Net1) ; port STATUS_LED
SW0: U1.AE18(IO_L31N_SM2_7)
SW1: U1.AF19(IO_L17P_7)
SW2: U1.AF20(IO_L17N_7)
SW3: U1.AF21(IO_L30P_SM3_7)
SW4: U1.AE21(IO_L32P_SM1_7)
TCK: R9.2 ; sheet U_FPGA_Power/TCK
TDI: R12.2 ; sheet U_FPGA_Power/TDI
TDO: R10.2 ; sheet U_FPGA_Power/TDO
TMS: R8.2 ; sheet U_FPGA_Power/TMS
UNUSED1: U1.D23(IO_L21P_5)
UNUSED2: U1.AB22(IO_L13N_7)
UNUSED3: U1.Y22(IO_L12P_7)
UNUSED4: U1.M8(IO_L9P_CC_LC_10)
UNUSED5: U1.L8(IO_L9N_CC_LC_10)
UNUSED6: U1.W22(IO_L3N_7)
VRN_7: U1.AD17(IO_L7P_GC_VRN_LC_4)
VRP_7: U1.AD16(IO_L7N_GC_VRP_LC_4)

Not connected (* = marked no-connect by the designer): U1 A3(IO_L14P_6)* A4(IO_L15P_6)* A5(IO_L6N_6)* A11(IO_L2N_GC_VRP_LC_3) AD7(IO_L23N_VRP_8)* AD20(IO_L23N_VRP_7)* AD25(IO_L11P_7)* AE7(IO_L23P_VRN_8)* AE20(IO_L23P_VRN_7)* B3(IO_L14N_6)* B4(IO_L15N_6)* C5(IO_L12P_6)* D5(IO_L12N_VREF_6)* E7(IO_L17P_6)* E9(IO_L7P_6)* G5(IO_L23N_VRP_6)* G6(IO_L23P_VRN_6)* G21(IO_L23N_VRP_5)* G22(IO_L23P_VRN_5)* H7(IO_L21N_6)* H8(IO_L21P_6)* N24(IO_L15N_9)* R5(IO_L23N_VRP_10)* R6(IO_L23P_VRN_10)* R21(IO_L23N_VRP_9)* R22(IO_L23P_VRN_9)* T21(IO_L30P_9)*

### Buses and harness runs
bus BUS_A[24..1]
bus BUS_D[31..0]
bus BUS_NBE[3..0]
bus DAU_TFT_BLUE[4..0]
bus DAU_TFT_CL[3..1]
bus DAU_TFT_GREEN[5..0]
bus DAU_TFT_RED[4..0]
bus DIP[7..0]
bus EXTEND_A[49..0]
bus EXTEND_B[49..0]
bus EXTEND_C[49..0]
bus FPGA_ID[3..0]
bus FPGA_M[2..0]
bus IO[35..0]
bus LED[7..0]
bus SRAM1_A[18..0]
bus SRAM1_D[15..0]
bus SRAM2_A[18..0]
bus SRAM2_D[15..0]
bus SW[4..0]

### Notes on the sheet
- DAUGHTER BOARD I/O
- HOST PERIPHERALS
- JTAG
- FPGA_ID = 0x0
- (Xilinx)
- PROGRAM
- Host Reset
- Status LEDs
- SPI BUS
- DAUGHTER BOARD MEMORY RESOURCES
- CLOCKS
- Shared Bypass Caps
- TFT LCD DISPLAY INTERFACE
- ONE-WIRE CONNECTIONS
- To permit DCI (terminated) inputs, the following must be done on each Bank:
  Tie the VRN pin (in each bank) through 50R to 3V3.
  Tie the VRP pin (in each bank) through 50R to GND.
- Pin Nets labeled "UNUSEDxx" are not used for any function, they are labeled for the purposes of FPGA pin swapping only.
- Project Title
- Sheet Title
- Size:
- Date:
- File:
- A2
- Assy:
- Time:
- Revision:
- Sheet
- of
- (in symbol D-241-0021, part A) BANK 1
- (in symbol D-241-0021, part B) BANK 2
- (in symbol D-241-0021, part C) BANK 3
- (in symbol D-241-0021, part D) BANK 4
- (in symbol D-241-0021, part E) BANK 5
- (in symbol D-241-0021, part F) BANK 6
- (in symbol D-241-0021, part G) BANK 7
- (in symbol D-241-0021, part H) BANK 8
- (in symbol D-241-0021, part I) BANK 9
- (in symbol D-241-0021, part J) BANK 10

### Library data of the parts
C23_CM C24_CM = D-101-0087: Capacitor, Ceramic, 10uF 10% 10V 0805 (2012) X5R; Polarity: Non-Polarized; Capacitance: 10 uF; Dielectric: X5R; Mounting Technology: Surface Mount; Rated Voltage: 10 V; Status: Unreleased; Technology: None; Tolerance: 10 %; Category: Capacitor
NT2-NT6 NT8 = D-002-0002: Net-Tie, Surface Mount, 2 x 0.4mm x 0.2mm SMT Pads - For 0.2mm Track; Status: Production; Category: Net-Tie
R1-R4 = D-100-0088: Resistor, 4K7 1% 0402 (1005); Power Rating: 63 mW; Resistance: 4.7 K; Mounting Technology: Surface Mount; Status: Production; Tolerance: 1 %; Category: Resistor
R7-R10 R12 R14 R18 R20 R22-R24 = D-100-0131: Resistor, 100R 1% 0402 (1005); Power Rating: 63 mW; Mounting Technology: Surface Mount; Resistance: 100 R; Status: Production; Tolerance: 1 %; Category: Resistor
U1 = D-241-0021: FPGA, Xilinx Virtex-4, XC4VSX35; Supply Voltage: mV; Mounting Technology: Surface Mount; Status: Production; Technology: None; Category: IC-FPGA

## Sheet FPGA_NonIO.SchDoc: FPGA Power & Programming
size A4; DocumentNumber: 8; SheetNumber: 8; SheetTotal: 23; Organization: Altium Limited.; Address1: Level 3, 12a Rodborough Rd; Address2: Frenchs Forest 2086; Address3: NSW; Address4: AUSTRALIA
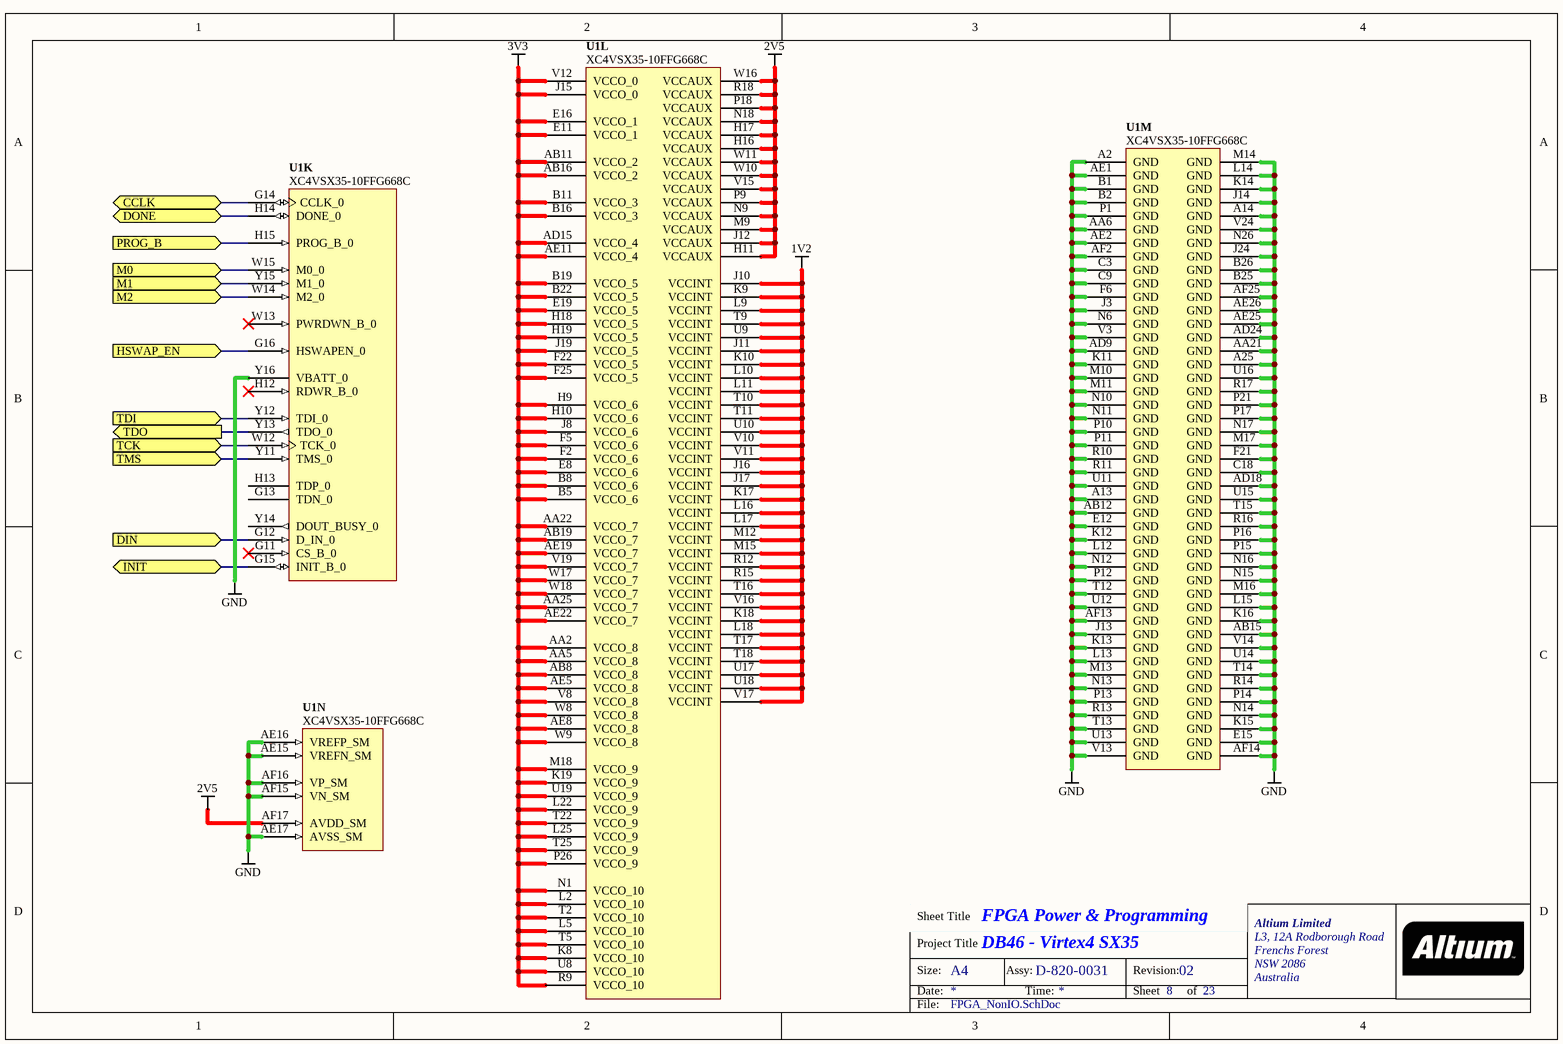
[diagram p3: FPGA_NonIO.SchDoc]

### Parts
U1  XC4VSX35-10FFG668C  [XC4VLX25-10FF668C]  (parts K,L,M,N of 14)

### Ports
CCLK (bidir), DIN (in), DONE (bidir), HSWAP_EN (in), INIT (bidir), M0 (in), M1 (in), M2 (in), PROG_B (in), TCK (in), TDI (in), TDO (out), TMS (in)

### Nets
1V2: U1.J10(VCCINT) U1.J11(VCCINT) U1.J16(VCCINT) U1.J17(VCCINT) U1.K9(VCCINT) U1.K10(VCCINT) U1.K17(VCCINT) U1.K18(VCCINT) U1.L9(VCCINT) U1.L10(VCCINT) U1.L11(VCCINT) U1.L16(VCCINT) U1.L17(VCCINT) U1.L18(VCCINT) U1.M12(VCCINT) U1.M15(VCCINT) U1.R12(VCCINT) U1.R15(VCCINT) U1.T9(VCCINT) U1.T10(VCCINT) U1.T11(VCCINT) U1.T16(VCCINT) U1.T17(VCCINT) U1.T18(VCCINT) U1.U9(VCCINT) U1.U10(VCCINT) U1.U17(VCCINT) U1.U18(VCCINT) U1.V10(VCCINT) U1.V11(VCCINT) U1.V16(VCCINT) U1.V17(VCCINT)
2V5: U1.AF17(AVDD_SM) U1.H11(VCCAUX) U1.H16(VCCAUX) U1.H17(VCCAUX) U1.J12(VCCAUX) U1.M9(VCCAUX) U1.N9(VCCAUX) U1.N18(VCCAUX) U1.P9(VCCAUX) U1.P18(VCCAUX) U1.R18(VCCAUX) U1.V15(VCCAUX) U1.W10(VCCAUX) U1.W11(VCCAUX) U1.W16(VCCAUX)
3V3: U1.AA2(VCCO_8) U1.AA5(VCCO_8) U1.AA22(VCCO_7) U1.AA25(VCCO_7) U1.AB8(VCCO_8) U1.AB11(VCCO_2) U1.AB16(VCCO_2) U1.AB19(VCCO_7) U1.AD15(VCCO_4) U1.AE5(VCCO_8) U1.AE8(VCCO_8) U1.AE11(VCCO_4) U1.AE19(VCCO_7) U1.AE22(VCCO_7) U1.B5(VCCO_6) U1.B8(VCCO_6) U1.B11(VCCO_3) U1.B16(VCCO_3) U1.B19(VCCO_5) U1.B22(VCCO_5) U1.E8(VCCO_6) U1.E11(VCCO_1) U1.E16(VCCO_1) U1.E19(VCCO_5) U1.F2(VCCO_6) U1.F5(VCCO_6) U1.F22(VCCO_5) U1.F25(VCCO_5) U1.H9(VCCO_6) U1.H10(VCCO_6) U1.H18(VCCO_5) U1.H19(VCCO_5) U1.J8(VCCO_6) U1.J15(VCCO_0) U1.J19(VCCO_5) U1.K8(VCCO_10) U1.K19(VCCO_9) U1.L2(VCCO_10) U1.L5(VCCO_10) U1.L22(VCCO_9) U1.L25(VCCO_9) U1.M18(VCCO_9) U1.N1(VCCO_10) U1.P26(VCCO_9) U1.R9(VCCO_10) U1.T2(VCCO_10) U1.T5(VCCO_10) U1.T22(VCCO_9) U1.T25(VCCO_9) U1.U8(VCCO_10) U1.U19(VCCO_9) U1.V8(VCCO_8) U1.V12(VCCO_0) U1.V19(VCCO_7) U1.W8(VCCO_8) U1.W9(VCCO_8) U1.W17(VCCO_7) U1.W18(VCCO_7)
GND: U1.A2(GND) U1.A13(GND) U1.A14(GND) U1.A25(GND) U1.AA6(GND) U1.AA21(GND) U1.AB12(GND) U1.AB15(GND) U1.AD9(GND) U1.AD18(GND) U1.AD24(GND) U1.AE1(GND) U1.AE2(GND) U1.AE15(VREFN_SM) U1.AE16(VREFP_SM) U1.AE17(AVSS_SM) U1.AE25(GND) U1.AE26(GND) U1.AF2(GND) U1.AF13(GND) U1.AF14(GND) U1.AF15(VN_SM) U1.AF16(VP_SM) U1.AF25(GND) U1.B1(GND) U1.B2(GND) U1.B25(GND) U1.B26(GND) U1.C3(GND) U1.C9(GND) U1.C18(GND) U1.E12(GND) U1.E15(GND) U1.F6(GND) U1.F21(GND) U1.J3(GND) U1.J13(GND) U1.J14(GND) U1.J24(GND) U1.K11(GND) U1.K12(GND) U1.K13(GND) U1.K14(GND) U1.K15(GND) U1.K16(GND) U1.L12(GND) U1.L13(GND) U1.L14(GND) U1.L15(GND) U1.M10(GND) U1.M11(GND) U1.M13(GND) U1.M14(GND) U1.M16(GND) U1.M17(GND) U1.N6(GND) U1.N10(GND) U1.N11(GND) U1.N12(GND) U1.N13(GND) U1.N14(GND) U1.N15(GND) U1.N16(GND) U1.N17(GND) U1.N26(GND) U1.P1(GND) U1.P10(GND) U1.P11(GND) U1.P12(GND) U1.P13(GND) U1.P14(GND) U1.P15(GND) U1.P16(GND) U1.P17(GND) U1.P21(GND) U1.R10(GND) U1.R11(GND) U1.R13(GND) U1.R14(GND) U1.R16(GND) U1.R17(GND) U1.T12(GND) U1.T13(GND) U1.T14(GND) U1.T15(GND) U1.U11(GND) U1.U12(GND) U1.U13(GND) U1.U14(GND) U1.U15(GND) U1.U16(GND) U1.V3(GND) U1.V13(GND) U1.V14(GND) U1.V24(GND) U1.Y16(VBATT_0)
CCLK: U1.G14(CCLK_0) ; port CCLK
DONE: U1.H14(DONE_0) ; port DONE
FPGA_DIN: U1.G12(D_IN_0) ; port DIN
FPGA_INIT: U1.G15(INIT_B_0) ; port INIT
HSWAP_EN: U1.G16(HSWAPEN_0) ; port HSWAP_EN
M0: U1.W15(M0_0) ; port M0
M1: U1.Y15(M1_0) ; port M1
M2: U1.W14(M2_0) ; port M2
PROG_B: U1.H15(PROG_B_0) ; port PROG_B
TCK: U1.W12(TCK_0) ; port TCK
TDI: U1.Y12(TDI_0) ; port TDI
TDO: U1.Y13(TDO_0) ; port TDO
TMS: U1.Y11(TMS_0) ; port TMS

Not connected (* = marked no-connect by the designer): U1 G11(CS_B_0)* G13(TDN_0) H12(RDWR_B_0)* H13(TDP_0) W13(PWRDWN_B_0)* Y14(DOUT_BUSY_0)

### Notes on the sheet
- Sheet Title
- Project Title
- Size:
- Date:
- A4
- Assy:
- Time:
- Revision:
- Sheet
- of
- File:

### Library data of the parts
U1 = D-241-0021: as U1 on sheet FPGA; Mounting Technology: Surface Mount; Status: Production; Technology: None; Category: IC-FPGA

## Sheet Bypass_FPGA_3V3.SchDoc: FPGA Bypass Capacitors for 3V3
size A4; Organization: Altium Limited.; Address1: Level 3, 12a Rodborough Rd; Address2: Frenchs Forest 2086; Address3: NSW; Address4: AUSTRALIA; DocumentNumber: 7; SheetNumber: 7; SheetTotal: 23
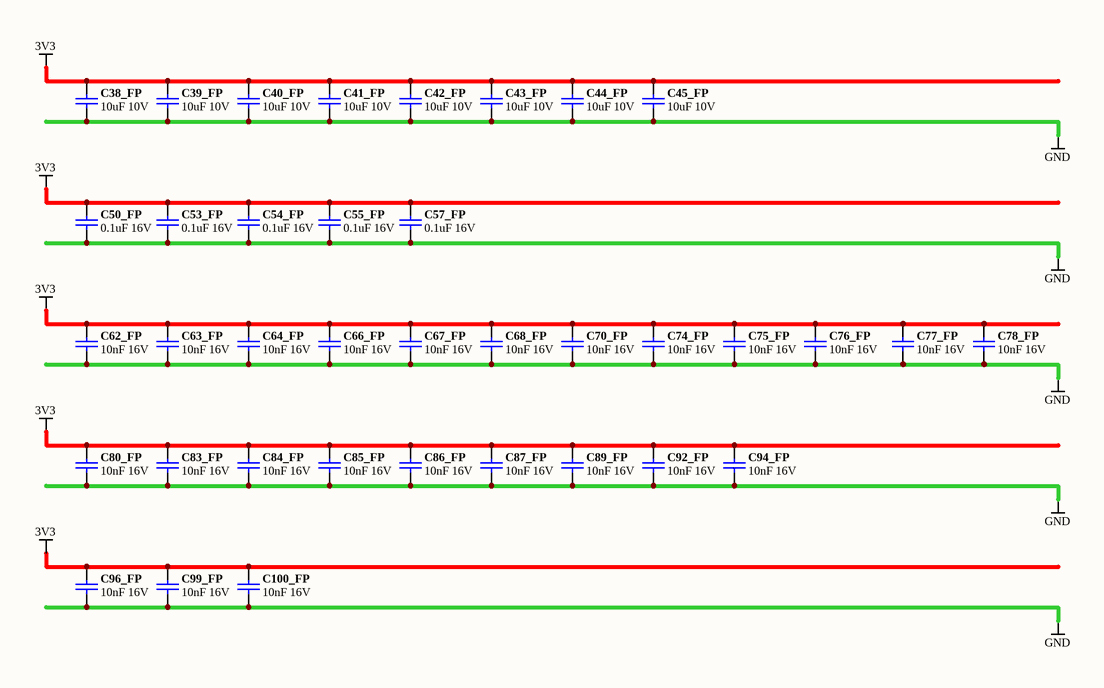
[diagram p4: Bypass_FPGA_3V3.SchDoc]

### Parts
C38_FP  10uF 10V  [CAPC2012-STAR]
C39_FP  10uF 10V  [CAPC2012-STAR]
C40_FP  10uF 10V  [CAPC2012-STAR]
C41_FP  10uF 10V  [CAPC2012-STAR]
C42_FP  10uF 10V  [CAPC2012-STAR]
C43_FP  10uF 10V  [CAPC2012-STAR]
C44_FP  10uF 10V  [CAPC2012-STAR]
C45_FP  10uF 10V  [CAPC2012-STAR]
C50_FP  0.1uF 16V  [CAPC1005-STAR]
C53_FP  0.1uF 16V  [CAPC1005-STAR]
C54_FP  0.1uF 16V  [CAPC1005-STAR]
C55_FP  0.1uF 16V  [CAPC1005-STAR]
C57_FP  0.1uF 16V  [CAPC1005-STAR]
C62_FP  10nF 16V  [CAPC1005-STAR]
C63_FP  10nF 16V  [CAPC1005-STAR]
C64_FP  10nF 16V  [CAPC1005-STAR]
C66_FP  10nF 16V  [CAPC1005-STAR]
C67_FP  10nF 16V  [CAPC1005-STAR]
C68_FP  10nF 16V  [CAPC1005-STAR]
C70_FP  10nF 16V  [CAPC1005-STAR]
C74_FP  10nF 16V  [CAPC1005-STAR]
C75_FP  10nF 16V  [CAPC1005-STAR]
C76_FP  10nF 16V  [CAPC1005-STAR]
C77_FP  10nF 16V  [CAPC1005-STAR]
C78_FP  10nF 16V  [CAPC1005-STAR]
C80_FP  10nF 16V  [CAPC1005-STAR]
C83_FP  10nF 16V  [CAPC1005-STAR]
C84_FP  10nF 16V  [CAPC1005-STAR]
C85_FP  10nF 16V  [CAPC1005-STAR]
C86_FP  10nF 16V  [CAPC1005-STAR]
C87_FP  10nF 16V  [CAPC1005-STAR]
C89_FP  10nF 16V  [CAPC1005-STAR]
C92_FP  10nF 16V  [CAPC1005-STAR]
C94_FP  10nF 16V  [CAPC1005-STAR]
C96_FP  10nF 16V  [CAPC1005-STAR]
C99_FP  10nF 16V  [CAPC1005-STAR]
C100_FP  10nF 16V  [CAPC1005-STAR]

### Nets
3V3: C38_FP.1 C39_FP.1 C40_FP.1 C41_FP.1 C42_FP.1 C43_FP.1 C44_FP.1 C45_FP.1 C50_FP.1 C53_FP.1 C54_FP.1 C55_FP.1 C57_FP.1 C62_FP.1 C63_FP.1 C64_FP.1 C66_FP.1 C67_FP.1 C68_FP.1 C70_FP.1 C74_FP.1 C75_FP.1 C76_FP.1 C77_FP.1 C78_FP.1 C80_FP.1 C83_FP.1 C84_FP.1 C85_FP.1 C86_FP.1 C87_FP.1 C89_FP.1 C92_FP.1 C94_FP.1 C96_FP.1 C99_FP.1 C100_FP.1
GND: C38_FP.2 C39_FP.2 C40_FP.2 C41_FP.2 C42_FP.2 C43_FP.2 C44_FP.2 C45_FP.2 C50_FP.2 C53_FP.2 C54_FP.2 C55_FP.2 C57_FP.2 C62_FP.2 C63_FP.2 C64_FP.2 C66_FP.2 C67_FP.2 C68_FP.2 C70_FP.2 C74_FP.2 C75_FP.2 C76_FP.2 C77_FP.2 C78_FP.2 C80_FP.2 C83_FP.2 C84_FP.2 C85_FP.2 C86_FP.2 C87_FP.2 C89_FP.2 C92_FP.2 C94_FP.2 C96_FP.2 C99_FP.2 C100_FP.2

### Notes on the sheet
- Sheet Title
- Project Title
- Size:
- Date:
- A4
- Assy:
- Time:
- Revision:
- Sheet
- of
- File:

### Library data of the parts
C38_FP C39_FP C40_FP C41_FP C42_FP C43_FP C44_FP C45_FP = D-101-0087: as C23_CM on sheet FPGA; Capacitance: 10 uF; Dielectric: X5R; Mounting Technology: Surface Mount; Rated Voltage: 10 V; Status: Unreleased; Technology: None; Tolerance: 10 %; Category: Capacitor
C50_FP C53_FP C54_FP C55_FP C57_FP = D-101-0080: Capacitor, Ceramic, 0.1uF 10% 16V 0402 (1005) X7R; Polarity: Non-Polarized; Capacitance: 0.1 uF; Dielectric: X7R; Mounting Technology: Surface Mount; Rated Voltage: 16 V; Status: Production; Technology: Ceramic; Tolerance: 10 %; Category: Capacitor
C62_FP C63_FP C64_FP C66_FP C67_FP C68_FP C70_FP C74_FP C75_FP C76_FP C77_FP C78_FP C80_FP C83_FP C84_FP C85_FP C86_FP C87_FP C89_FP C92_FP C94_FP C96_FP C99_FP C100_FP = D-101-0077: Capacitor, Ceramic, 10nF 10% 16V 0402 (1005) X7R; Polarity: Non-Polarized; Capacitance: 10 nF; Dielectric: X7R; Mounting Technology: Surface Mount; Rated Voltage: 16 V; Status: Production; Technology: Ceramic; Tolerance: 10 %; Category: Capacitor

## Sheet Bypass_FPGA_2V5.SCHDOC: FPGA Bypass Capacitors for 2V5
size A4; Organization: Altium Limited.; Address1: Level 3, 12a Rodborough Rd; Address2: Frenchs Forest 2086; Address3: NSW; Address4: AUSTRALIA; DocumentNumber: 6; SheetNumber: 6; SheetTotal: 23
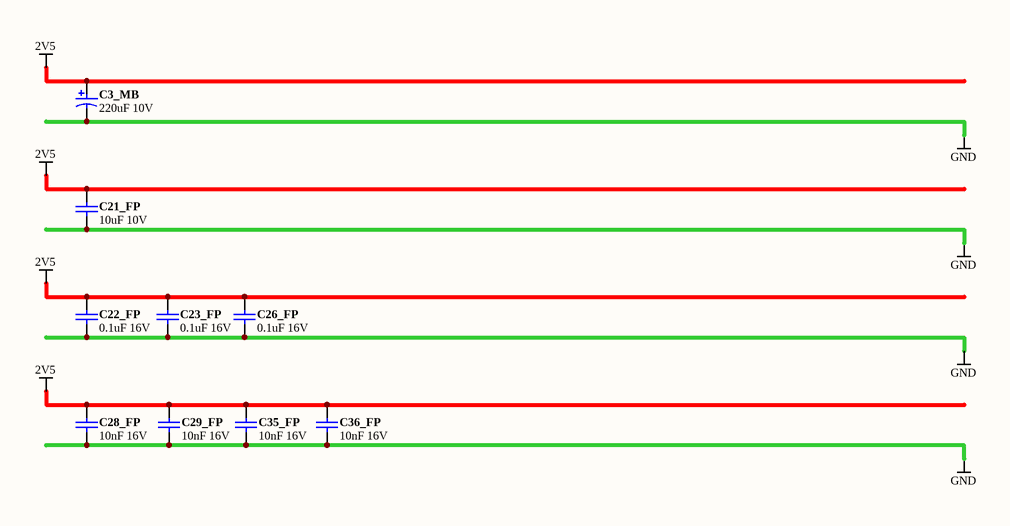
[diagram p5: Bypass_FPGA_2V5.SCHDOC]

### Parts
C3_MB  220uF 10V  [CAPC7343-STAR]
C21_FP  10uF 10V  [CAPC2012-STAR]
C22_FP  0.1uF 16V  [CAPC1005-STAR]
C23_FP  0.1uF 16V  [CAPC1005-STAR]
C26_FP  0.1uF 16V  [CAPC1005-STAR]
C28_FP  10nF 16V  [CAPC1005-STAR]
C29_FP  10nF 16V  [CAPC1005-STAR]
C35_FP  10nF 16V  [CAPC1005-STAR]
C36_FP  10nF 16V  [CAPC1005-STAR]

### Nets
2V5: C3_MB.1 C21_FP.1 C22_FP.1 C23_FP.1 C26_FP.1 C28_FP.1 C29_FP.1 C35_FP.1 C36_FP.1
GND: C3_MB.2 C21_FP.2 C22_FP.2 C23_FP.2 C26_FP.2 C28_FP.2 C29_FP.2 C35_FP.2 C36_FP.2

### Notes on the sheet
- Sheet Title
- Project Title
- Size:
- Date:
- A4
- Assy:
- Time:
- Revision:
- Sheet
- of
- File:

### Library data of the parts
C3_MB = D-101-0088: Capacitor, Tantalum, 220uF 10% 10V MCCT-D (7343-31); Polarity: Polarized; Capacitance: 220 uF; Mounting Technology: Surface Mount; Rated Voltage: 10 V; Status: Unreleased; Technology: Tantalum; Tolerance: 10 %; Category: Capacitor
C21_FP = D-101-0087: as C23_CM on sheet FPGA; Capacitance: 10 uF; Dielectric: X5R; Mounting Technology: Surface Mount; Rated Voltage: 10 V; Status: Unreleased; Technology: None; Tolerance: 10 %; Category: Capacitor
C22_FP C23_FP C26_FP = D-101-0080: as C50_FP on sheet Bypass_FPGA_3V3; Capacitance: 0.1 uF; Dielectric: X7R; Mounting Technology: Surface Mount; Rated Voltage: 16 V; Status: Production; Technology: Ceramic; Tolerance: 10 %; Category: Capacitor
C28_FP C29_FP C35_FP C36_FP = D-101-0077: as C62_FP on sheet Bypass_FPGA_3V3; Capacitance: 10 nF; Dielectric: X7R; Mounting Technology: Surface Mount; Rated Voltage: 16 V; Status: Production; Technology: Ceramic; Tolerance: 10 %; Category: Capacitor

## Sheet Bypass_FPGA_1V2.SCHDOC: FPGA Bypass Capacitors for 1V2
size A4; Organization: Altium Limited.; Address1: Level 3, 12a Rodborough Rd; Address2: Frenchs Forest 2086; Address3: NSW; Address4: AUSTRALIA; DocumentNumber: 5; SheetNumber: 5; SheetTotal: 23
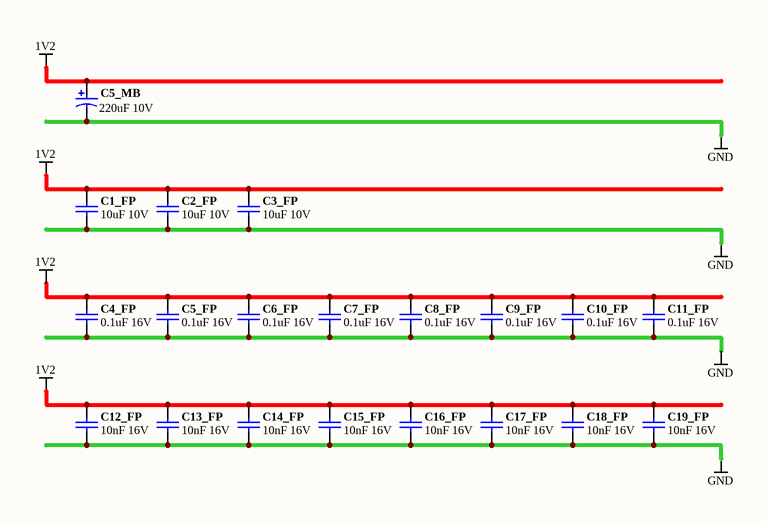
[diagram p6: Bypass_FPGA_1V2.SCHDOC]

### Parts
C1_FP  10uF 10V  [CAPC2012-STAR]
C2_FP  10uF 10V  [CAPC2012-STAR]
C3_FP  10uF 10V  [CAPC2012-STAR]
C4_FP  0.1uF 16V  [CAPC1005-STAR]
C5_FP  0.1uF 16V  [CAPC1005-STAR]
C5_MB  220uF 10V  [CAPC7343-STAR]
C6_FP  0.1uF 16V  [CAPC1005-STAR]
C7_FP  0.1uF 16V  [CAPC1005-STAR]
C8_FP  0.1uF 16V  [CAPC1005-STAR]
C9_FP  0.1uF 16V  [CAPC1005-STAR]
C10_FP  0.1uF 16V  [CAPC1005-STAR]
C11_FP  0.1uF 16V  [CAPC1005-STAR]
C12_FP  10nF 16V  [CAPC1005-STAR]
C13_FP  10nF 16V  [CAPC1005-STAR]
C14_FP  10nF 16V  [CAPC1005-STAR]
C15_FP  10nF 16V  [CAPC1005-STAR]
C16_FP  10nF 16V  [CAPC1005-STAR]
C17_FP  10nF 16V  [CAPC1005-STAR]
C18_FP  10nF 16V  [CAPC1005-STAR]
C19_FP  10nF 16V  [CAPC1005-STAR]

### Nets
1V2: C1_FP.1 C2_FP.1 C3_FP.1 C4_FP.1 C5_FP.1 C5_MB.1 C6_FP.1 C7_FP.1 C8_FP.1 C9_FP.1 C10_FP.1 C11_FP.1 C12_FP.1 C13_FP.1 C14_FP.1 C15_FP.1 C16_FP.1 C17_FP.1 C18_FP.1 C19_FP.1
GND: C1_FP.2 C2_FP.2 C3_FP.2 C4_FP.2 C5_FP.2 C5_MB.2 C6_FP.2 C7_FP.2 C8_FP.2 C9_FP.2 C10_FP.2 C11_FP.2 C12_FP.2 C13_FP.2 C14_FP.2 C15_FP.2 C16_FP.2 C17_FP.2 C18_FP.2 C19_FP.2

### Notes on the sheet
- Sheet Title
- Project Title
- Size:
- Date:
- A4
- Assy:
- Time:
- Revision:
- Sheet
- of
- File:

### Library data of the parts
C1_FP C2_FP C3_FP = D-101-0087: as C23_CM on sheet FPGA; Capacitance: 10 uF; Dielectric: X5R; Mounting Technology: Surface Mount; Rated Voltage: 10 V; Status: Unreleased; Technology: None; Tolerance: 10 %; Category: Capacitor
C4_FP C5_FP C6_FP C7_FP C8_FP C9_FP C10_FP C11_FP = D-101-0080: as C50_FP on sheet Bypass_FPGA_3V3; Capacitance: 0.1 uF; Dielectric: X7R; Mounting Technology: Surface Mount; Rated Voltage: 16 V; Status: Production; Technology: Ceramic; Tolerance: 10 %; Category: Capacitor
C5_MB = D-101-0088: as C3_MB on sheet Bypass_FPGA_2V5; Capacitance: 220 uF; Mounting Technology: Surface Mount; Rated Voltage: 10 V; Status: Unreleased; Technology: Tantalum; Tolerance: 10 %; Category: Capacitor
C12_FP C13_FP C14_FP C15_FP C16_FP C17_FP C18_FP C19_FP = D-101-0077: as C62_FP on sheet Bypass_FPGA_3V3; Capacitance: 10 nF; Dielectric: X7R; Mounting Technology: Surface Mount; Rated Voltage: 16 V; Status: Production; Technology: Ceramic; Tolerance: 10 %; Category: Capacitor

## Sheet DB46_Top.SchDoc: DB46 Top Level
size A4; Organization: Altium Limited.; Address1: Level 3, 12a Rodborough Rd; Address2: Frenchs Forest 2086; Address3: NSW; Address4: AUSTRALIA; DocumentNumber: 1; SheetNumber: 2; SheetTotal: 23
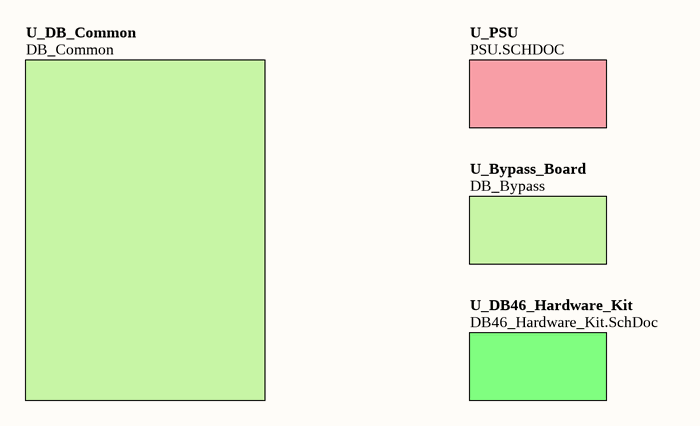
[diagram p7: DB46_Top.SchDoc]

### Sub-sheets
U_Bypass_Board = DB_Bypass (file not in this document): no entries
U_DB46_Hardware_Kit = DB46_Hardware_Kit.SchDoc: no entries
U_DB_Common = DB_Common (file not in this document): no entries
U_PSU = PSU.SCHDOC: no entries

### Notes on the sheet
- Sheet Title
- Project Title
- Size:
- Date:
- A4
- Assy:
- Time:
- Revision:
- Sheet
- of
- File:

## Sheet PSU.SCHDOC: Power Supply Top Level
size A4; Organization: Altium Limited.; Address1: Level 3, 12a Rodborough Rd; Address2: Frenchs Forest 2086; Address3: NSW; Address4: AUSTRALIA; DocumentNumber: 10; SheetNumber: 10; SheetTotal: 23
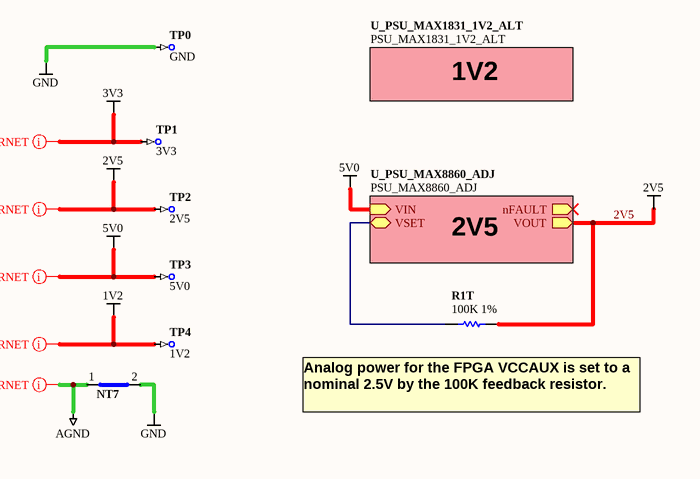
[diagram p8: PSU.SCHDOC]

### Parts
NT7  Net Tie SMT2  [NETTIE-SMT2-8X8]  (value not drawn)  (net tie, no BOM)
R1T  100K 1%  [RESC1005-STAR]
TP0  GND  [TestPin]  (no BOM)
TP1  3V3  [TestPin]  (no BOM)
TP2  2V5  [TestPin]  (no BOM)
TP3  5V0  [TestPin]  (no BOM)
TP4  1V2  [TestPin]  (no BOM)

### Sub-sheets
U_PSU_MAX1831_1V2_ALT = PSU_MAX1831_1V2_ALT (file not in this document): no entries
U_PSU_MAX8860_ADJ = PSU_MAX8860_ADJ (file not in this document): nFAULT (out), VIN (in), VOUT (out), VSET (bidir)

### Nets
1V2: TP4.1
2V5: R1T.2 TP2.1 ; sheet U_PSU_MAX8860_ADJ/VOUT
3V3: TP1.1
5V0: TP3.1 ; sheet U_PSU_MAX8860_ADJ/VIN
AGND: NT7.1(Net1)
GND: NT7.2(Net2) TP0.1
NetR1T_1: R1T.1 ; sheet U_PSU_MAX8860_ADJ/VSET

### Layout directives
net class PWRNET: 1V2, 2V5, 3V3, 5V0, AGND

### Notes on the sheet
- 1V2
- 2V5
- (near R1T) Analog power for the FPGA VCCAUX is set to a nominal 2.5V by the 100K feedback resistor.
- Sheet Title
- Project Title
- Size:
- Date:
- A4
- Assy:
- Time:
- Revision:
- Sheet
- of
- File:

### Library data of the parts
NT7 = D-002-0002: as NT2 on sheet FPGA; Status: Production; Category: Net-Tie
R1T = D-100-0132: Resistor, 100K 1% 0402 (1005); Power Rating: 63 mW; Mounting Technology: Surface Mount; Resistance: 100 K; Status: Production; Tolerance: 1 %; Category: Resistor
TP0-TP4 = D-006-0000: Test Point, PCB Mount with Silkscreen Box; Status: Production; Category: Test-Point

## Sheet DB46_Hardware_Kit.SchDoc: DB46 Hardware Kit
size A4; Organization: Altium Limited.; Address1: Level 3, 12a Rodborough Rd; Address2: Frenchs Forest 2086; Address3: NSW; Address4: AUSTRALIA; DocumentNumber: 9; SheetNumber: 9; SheetTotal: 23
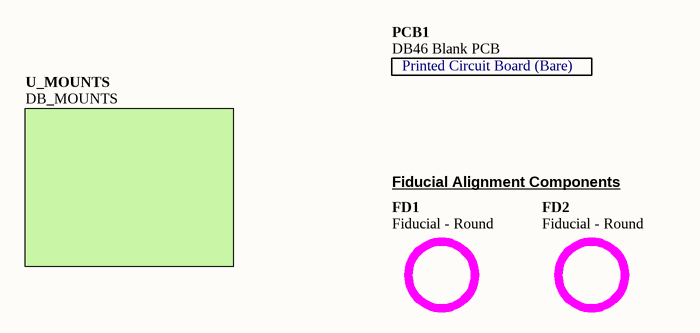
[diagram p9: DB46_Hardware_Kit.SchDoc]

### Parts
FD1  Fiducial - Round  [FIDUCIAL ROUND]
FD2  Fiducial - Round  [FIDUCIAL ROUND]
PCB1  DB46 Blank PCB  [DB46 Blank PCB]

### Sub-sheets
U_MOUNTS = DB_MOUNTS (file not in this document): no entries

### Notes on the sheet
- Fiducial Alignment Components
- Sheet Title
- Project Title
- Size:
- Date:
- A4
- Assy:
- Time:
- Revision:
- Sheet
- of
- File:
- (in symbol D-810-0034) Printed Circuit Board (Bare)

### Library data of the parts
FD1 FD2 = D-000-0005: Fiducial - Round 1.5mm Top-Bottom; Status: Unreleased; Category: Graphic-PCB
PCB1 = D-810-0034: DB46 Blank PCB - Daughter Board; ProjectPath: DB46.PrjPCB; Status: Unreleased; Category: Blank PCB

## Nets that join several sheets
1V2: FPGA_NonIO (32 pins), Bypass_FPGA_1V2 (20 pins), PSU (TP4.1)
2V5: FPGA_NonIO (15 pins), Bypass_FPGA_2V5 (9 pins), PSU (R1T.2 TP2.1)
3V3: FPGA (6 pins), FPGA_NonIO (58 pins), Bypass_FPGA_3V3 (37 pins), PSU (TP1.1)
GND: FPGA (6 pins), FPGA_NonIO (96 pins), Bypass_FPGA_3V3 (37 pins), Bypass_FPGA_2V5 (9 pins), Bypass_FPGA_1V2 (20 pins), PSU (NT7.2 TP0.1)
CCLK: FPGA (R20.2), FPGA_NonIO (U1.G14)
DONE: FPGA (R22.2), FPGA_NonIO (U1.H14)
FPGA_INIT: FPGA (R3.1), FPGA_NonIO (U1.G15)
HSWAP_EN: FPGA (R7.2), FPGA_NonIO (U1.G16)
M0: FPGA (R23.2), FPGA_NonIO (U1.W15)
M1: FPGA (R18.2), FPGA_NonIO (U1.Y15)
M2: FPGA (R14.2), FPGA_NonIO (U1.W14)
PROG_B: FPGA (R24.2), FPGA_NonIO (U1.H15)
TCK: FPGA (R9.2), FPGA_NonIO (U1.W12)
TDI: FPGA (R12.2), FPGA_NonIO (U1.Y12)
TDO: FPGA (R10.2), FPGA_NonIO (U1.Y13)
TMS: FPGA (R8.2), FPGA_NonIO (U1.Y11)

## Assembly variants
Production: not fitted RN1 RN2 RN3 RN4 RN5 RN6 RN7 RN8 RN17 RN18 RN19 RN20 RN21 RN22 RN23 RN24 RN25 RN26 RN27 RN28 RN29 RN30 RN31 RN32